# Altium project WeatherChannel.PrjPCB
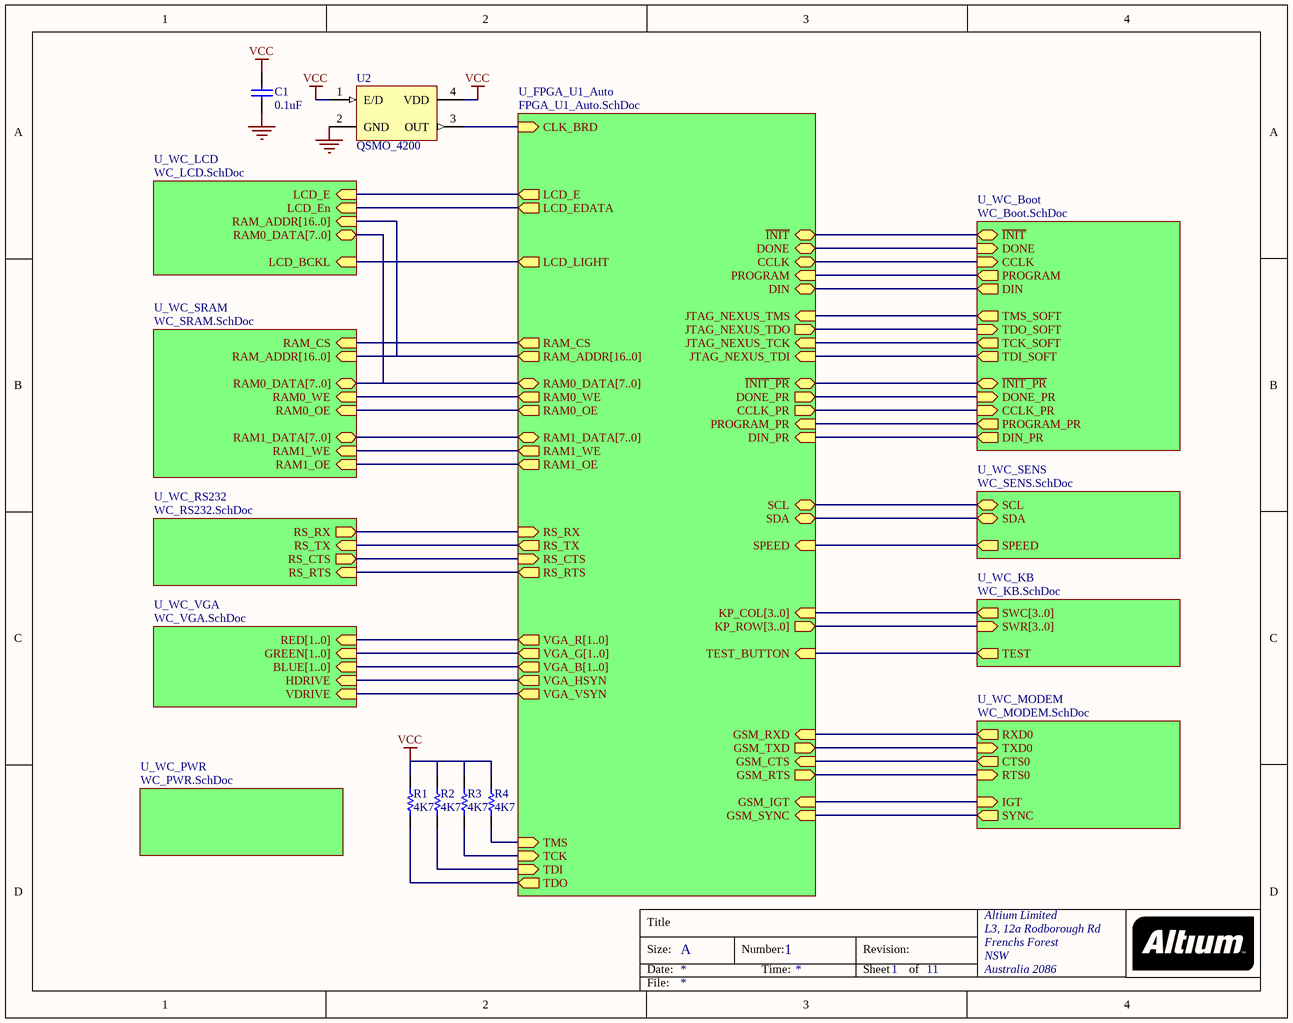
[diagram p0: FPGA_U1_Manual.SchDoc]
11 sheets, 128 parts. Net scope: hierarchical (ports join the sheet entries above them; power ports are global).
Board file: WeatherChannel.PcbDoc
Sheets:
  FPGA_U1_Manual.SchDoc
    U_FPGA_U1_Auto = FPGA_U1_Auto.SchDoc
    U_WC_SENS = WC_SENS.SchDoc
    U_WC_LCD = WC_LCD.SchDoc
    U_WC_SRAM = WC_SRAM.SchDoc
    U_WC_VGA = WC_VGA.SchDoc
    U_WC_RS232 = WC_RS232.SchDoc
    U_WC_KB = WC_KB.SchDoc
    U_WC_PWR = WC_PWR.SchDoc
    U_WC_Boot = WC_Boot.SchDoc
    U_WC_MODEM = WC_MODEM.SchDoc

## Sheet FPGA_U1_Manual.SchDoc
size A; Organization: Altium Limited; Address1: L3, 12a Rodborough Rd; Address2: Frenchs Forest; Address3: NSW; Address4: Australia 2086; DocumentNumber: 1; SheetNumber: 1; SheetTotal: 11

### Parts
C1  0.1uF  [CC2012-0805]
R1  4K7  [CC2012-0805]
R2  4K7  [CC2012-0805]
R3  4K7  [CC2012-0805]
R4  4K7  [CC2012-0805]
U2  QSMO_4200  [QSMO_4200]

### Sub-sheets
U_FPGA_U1_Auto = FPGA_U1_Auto.SchDoc: CLK_BRD (in), SPEED (in), JTAG_NEXUS_TCK (in), JTAG_NEXUS_TDI (in), JTAG_NEXUS_TDO (out), JTAG_NEXUS_TMS (in), KP_COL[3..0] (in), KP_ROW[3..0] (out), LCD_E (out), LCD_EDATA (out), LCD_LIGHT (out), RAM_ADDR[16..0] (out), RAM_CS (out), RAM0_DATA[7..0] (bidir), RAM0_OE (out), RAM0_WE (out), RAM1_DATA[7..0] (bidir), RAM1_OE (out), RAM1_WE (out), RS_CTS (in), RS_RTS (out), RS_RX (in), RS_TX (out), SCL (bidir), SDA (bidir), TEST_BUTTON (in), VGA_B[1..0] (out), VGA_G[1..0] (out), VGA_HSYN (out), VGA_R[1..0] (out), VGA_VSYN (out), CCLK (bidir), DONE (bidir), PROGRAM (in), TCK (in), TDI (in), TDO (out), TMS (in), GSM_CTS (in), GSM_IGT (in), GSM_RTS (out), GSM_RXD (in), GSM_SYNC (in), GSM_TXD (out), CCLK_PR (out), DIN_PR (in), DONE_PR (out), PROGRAM_PR (in), ~{INIT_PR} (bidir), ~{INIT} (bidir), DIN (bidir)
U_WC_Boot = WC_Boot.SchDoc: ~{INIT} (bidir), DONE (in), CCLK (in), ~{INIT_PR} (bidir), DONE_PR (in), CCLK_PR (in), DIN (out), DIN_PR (out), PROGRAM (out), PROGRAM_PR (out), TMS_SOFT (out), TDO_SOFT (in), TCK_SOFT (out), TDI_SOFT (out)
U_WC_KB = WC_KB.SchDoc: TEST (out), SWR[3..0] (in), SWC[3..0] (out)
U_WC_LCD = WC_LCD.SchDoc: LCD_E (in), LCD_BCKL (in), LCD_En (in), RAM0_DATA[7..0] (bidir), RAM_ADDR[16..0] (in)
U_WC_MODEM = WC_MODEM.SchDoc: TXD0 (in), RXD0 (out), IGT (in), RTS0 (in), CTS0 (out), SYNC (out)
U_WC_PWR = WC_PWR.SchDoc: no entries
U_WC_RS232 = WC_RS232.SchDoc: RS_RTS (in), RS_TX (in), RS_CTS (out), RS_RX (out)
U_WC_SENS = WC_SENS.SchDoc: SCL (bidir), SDA (bidir), SPEED (out)
U_WC_SRAM = WC_SRAM.SchDoc: RAM0_WE (in), RAM0_OE (in), RAM1_WE (in), RAM1_OE (in), RAM_CS (in), RAM0_DATA[7..0] (bidir), RAM1_DATA[7..0] (bidir), RAM_ADDR[16..0] (in)
U_WC_VGA = WC_VGA.SchDoc: RED[1..0] (in), GREEN[1..0] (in), BLUE[1..0] (in), HDRIVE (in), VDRIVE (in)

### Nets
GND: C1.2 U2.2(GND)
VCC: C1.1 R1.1 R2.1 R3.1 R4.1 U2.1(E/D) U2.4(VDD)
CCLK: sheet U_FPGA_U1_Auto/CCLK, sheet U_WC_Boot/CCLK
CCLK_PR: sheet U_FPGA_U1_Auto/CCLK_PR, sheet U_WC_Boot/CCLK_PR
CLK_BRD: U2.3(OUT) ; sheet U_FPGA_U1_Auto/CLK_BRD
DIN: sheet U_FPGA_U1_Auto/DIN, sheet U_WC_Boot/DIN
DIN_PR: sheet U_FPGA_U1_Auto/DIN_PR, sheet U_WC_Boot/DIN_PR
DONE: sheet U_FPGA_U1_Auto/DONE, sheet U_WC_Boot/DONE
DONE_PR: sheet U_FPGA_U1_Auto/DONE_PR, sheet U_WC_Boot/DONE_PR
GSM_CTS: sheet U_FPGA_U1_Auto/GSM_CTS, sheet U_WC_MODEM/CTS0
GSM_IGT: sheet U_FPGA_U1_Auto/GSM_IGT, sheet U_WC_MODEM/IGT
GSM_RTS: sheet U_FPGA_U1_Auto/GSM_RTS, sheet U_WC_MODEM/RTS0
GSM_RXD: sheet U_FPGA_U1_Auto/GSM_RXD, sheet U_WC_MODEM/RXD0
GSM_SYNC: sheet U_FPGA_U1_Auto/GSM_SYNC, sheet U_WC_MODEM/SYNC
GSM_TXD: sheet U_FPGA_U1_Auto/GSM_TXD, sheet U_WC_MODEM/TXD0
~{INIT}: sheet U_FPGA_U1_Auto/~{INIT}, sheet U_WC_Boot/~{INIT}
~{INIT_PR}: sheet U_FPGA_U1_Auto/~{INIT_PR}, sheet U_WC_Boot/~{INIT_PR}
JTAG_NEXUS_TCK: sheet U_FPGA_U1_Auto/JTAG_NEXUS_TCK, sheet U_WC_Boot/TCK_SOFT
JTAG_NEXUS_TDI: sheet U_FPGA_U1_Auto/JTAG_NEXUS_TDI, sheet U_WC_Boot/TDI_SOFT
JTAG_NEXUS_TDO: sheet U_FPGA_U1_Auto/JTAG_NEXUS_TDO, sheet U_WC_Boot/TDO_SOFT
JTAG_NEXUS_TMS: sheet U_FPGA_U1_Auto/JTAG_NEXUS_TMS, sheet U_WC_Boot/TMS_SOFT
LCD_BCKL: sheet U_FPGA_U1_Auto/LCD_LIGHT, sheet U_WC_LCD/LCD_BCKL
LCD_E: sheet U_FPGA_U1_Auto/LCD_E, sheet U_WC_LCD/LCD_E
LCD_EDATA: sheet U_FPGA_U1_Auto/LCD_EDATA, sheet U_WC_LCD/LCD_En
PROGRAM: sheet U_FPGA_U1_Auto/PROGRAM, sheet U_WC_Boot/PROGRAM
PROGRAM_PR: sheet U_FPGA_U1_Auto/PROGRAM_PR, sheet U_WC_Boot/PROGRAM_PR
RAM0_OE: sheet U_FPGA_U1_Auto/RAM0_OE, sheet U_WC_SRAM/RAM0_OE
RAM0_WE: sheet U_FPGA_U1_Auto/RAM0_WE, sheet U_WC_SRAM/RAM0_WE
RAM1_OE: sheet U_FPGA_U1_Auto/RAM1_OE, sheet U_WC_SRAM/RAM1_OE
RAM1_WE: sheet U_FPGA_U1_Auto/RAM1_WE, sheet U_WC_SRAM/RAM1_WE
RAM_CS: sheet U_FPGA_U1_Auto/RAM_CS, sheet U_WC_SRAM/RAM_CS
RS_CTS: sheet U_FPGA_U1_Auto/RS_CTS, sheet U_WC_RS232/RS_CTS
RS_RTS: sheet U_FPGA_U1_Auto/RS_RTS, sheet U_WC_RS232/RS_RTS
RS_RX: sheet U_FPGA_U1_Auto/RS_RX, sheet U_WC_RS232/RS_RX
RS_TX: sheet U_FPGA_U1_Auto/RS_TX, sheet U_WC_RS232/RS_TX
SCL: sheet U_FPGA_U1_Auto/SCL, sheet U_WC_SENS/SCL
SDA: sheet U_FPGA_U1_Auto/SDA, sheet U_WC_SENS/SDA
SPEED: sheet U_FPGA_U1_Auto/SPEED, sheet U_WC_SENS/SPEED
TCK: R3.2 ; sheet U_FPGA_U1_Auto/TCK
TDI: R2.2 ; sheet U_FPGA_U1_Auto/TDI
TDO: R1.2 ; sheet U_FPGA_U1_Auto/TDO
TEST: sheet U_FPGA_U1_Auto/TEST_BUTTON, sheet U_WC_KB/TEST
TMS: R4.2 ; sheet U_FPGA_U1_Auto/TMS
VGA_HSYN: sheet U_FPGA_U1_Auto/VGA_HSYN, sheet U_WC_VGA/HDRIVE
VGA_VSYN: sheet U_FPGA_U1_Auto/VGA_VSYN, sheet U_WC_VGA/VDRIVE

### Buses and harness runs
bus sheet U_FPGA_U1_Auto/KP_COL[3..0] = sheet U_WC_KB/SWC[3..0]
bus sheet U_FPGA_U1_Auto/KP_ROW[3..0] = sheet U_WC_KB/SWR[3..0]
bus sheet U_FPGA_U1_Auto/RAM0_DATA[7..0] = sheet U_WC_LCD/RAM0_DATA[7..0] = sheet U_WC_SRAM/RAM0_DATA[7..0]
bus sheet U_FPGA_U1_Auto/RAM1_DATA[7..0] = sheet U_WC_SRAM/RAM1_DATA[7..0]
bus sheet U_FPGA_U1_Auto/RAM_ADDR[16..0] = sheet U_WC_LCD/RAM_ADDR[16..0] = sheet U_WC_SRAM/RAM_ADDR[16..0]
bus sheet U_FPGA_U1_Auto/VGA_B[1..0] = sheet U_WC_VGA/BLUE[1..0]
bus sheet U_FPGA_U1_Auto/VGA_G[1..0] = sheet U_WC_VGA/GREEN[1..0]
bus sheet U_FPGA_U1_Auto/VGA_R[1..0] = sheet U_WC_VGA/RED[1..0]

### Notes on the sheet
- Title
- Size:
- Date:
- A
- Number:
- Time:
- Revision:
- Sheet
- of
- File:

### Library data of the parts
C1 = CAP: Capacitor
R1-R4 = RES: Resistor
U2 = QSMO_4200: Surface Mount Crystal Oscillator

## Sheet FPGA_U1_Auto.SchDoc
size A2; Generated From FPGA Project: WeatherChannel.PrjFpg; UNUSED_SPECIAL: RouteSeparate; UNUSED_IO: NoERC; VREF: NoERC; UNUSED_INPUT: NoERC; DocumentNumber: 11; SheetNumber: 11; SheetTotal: 11
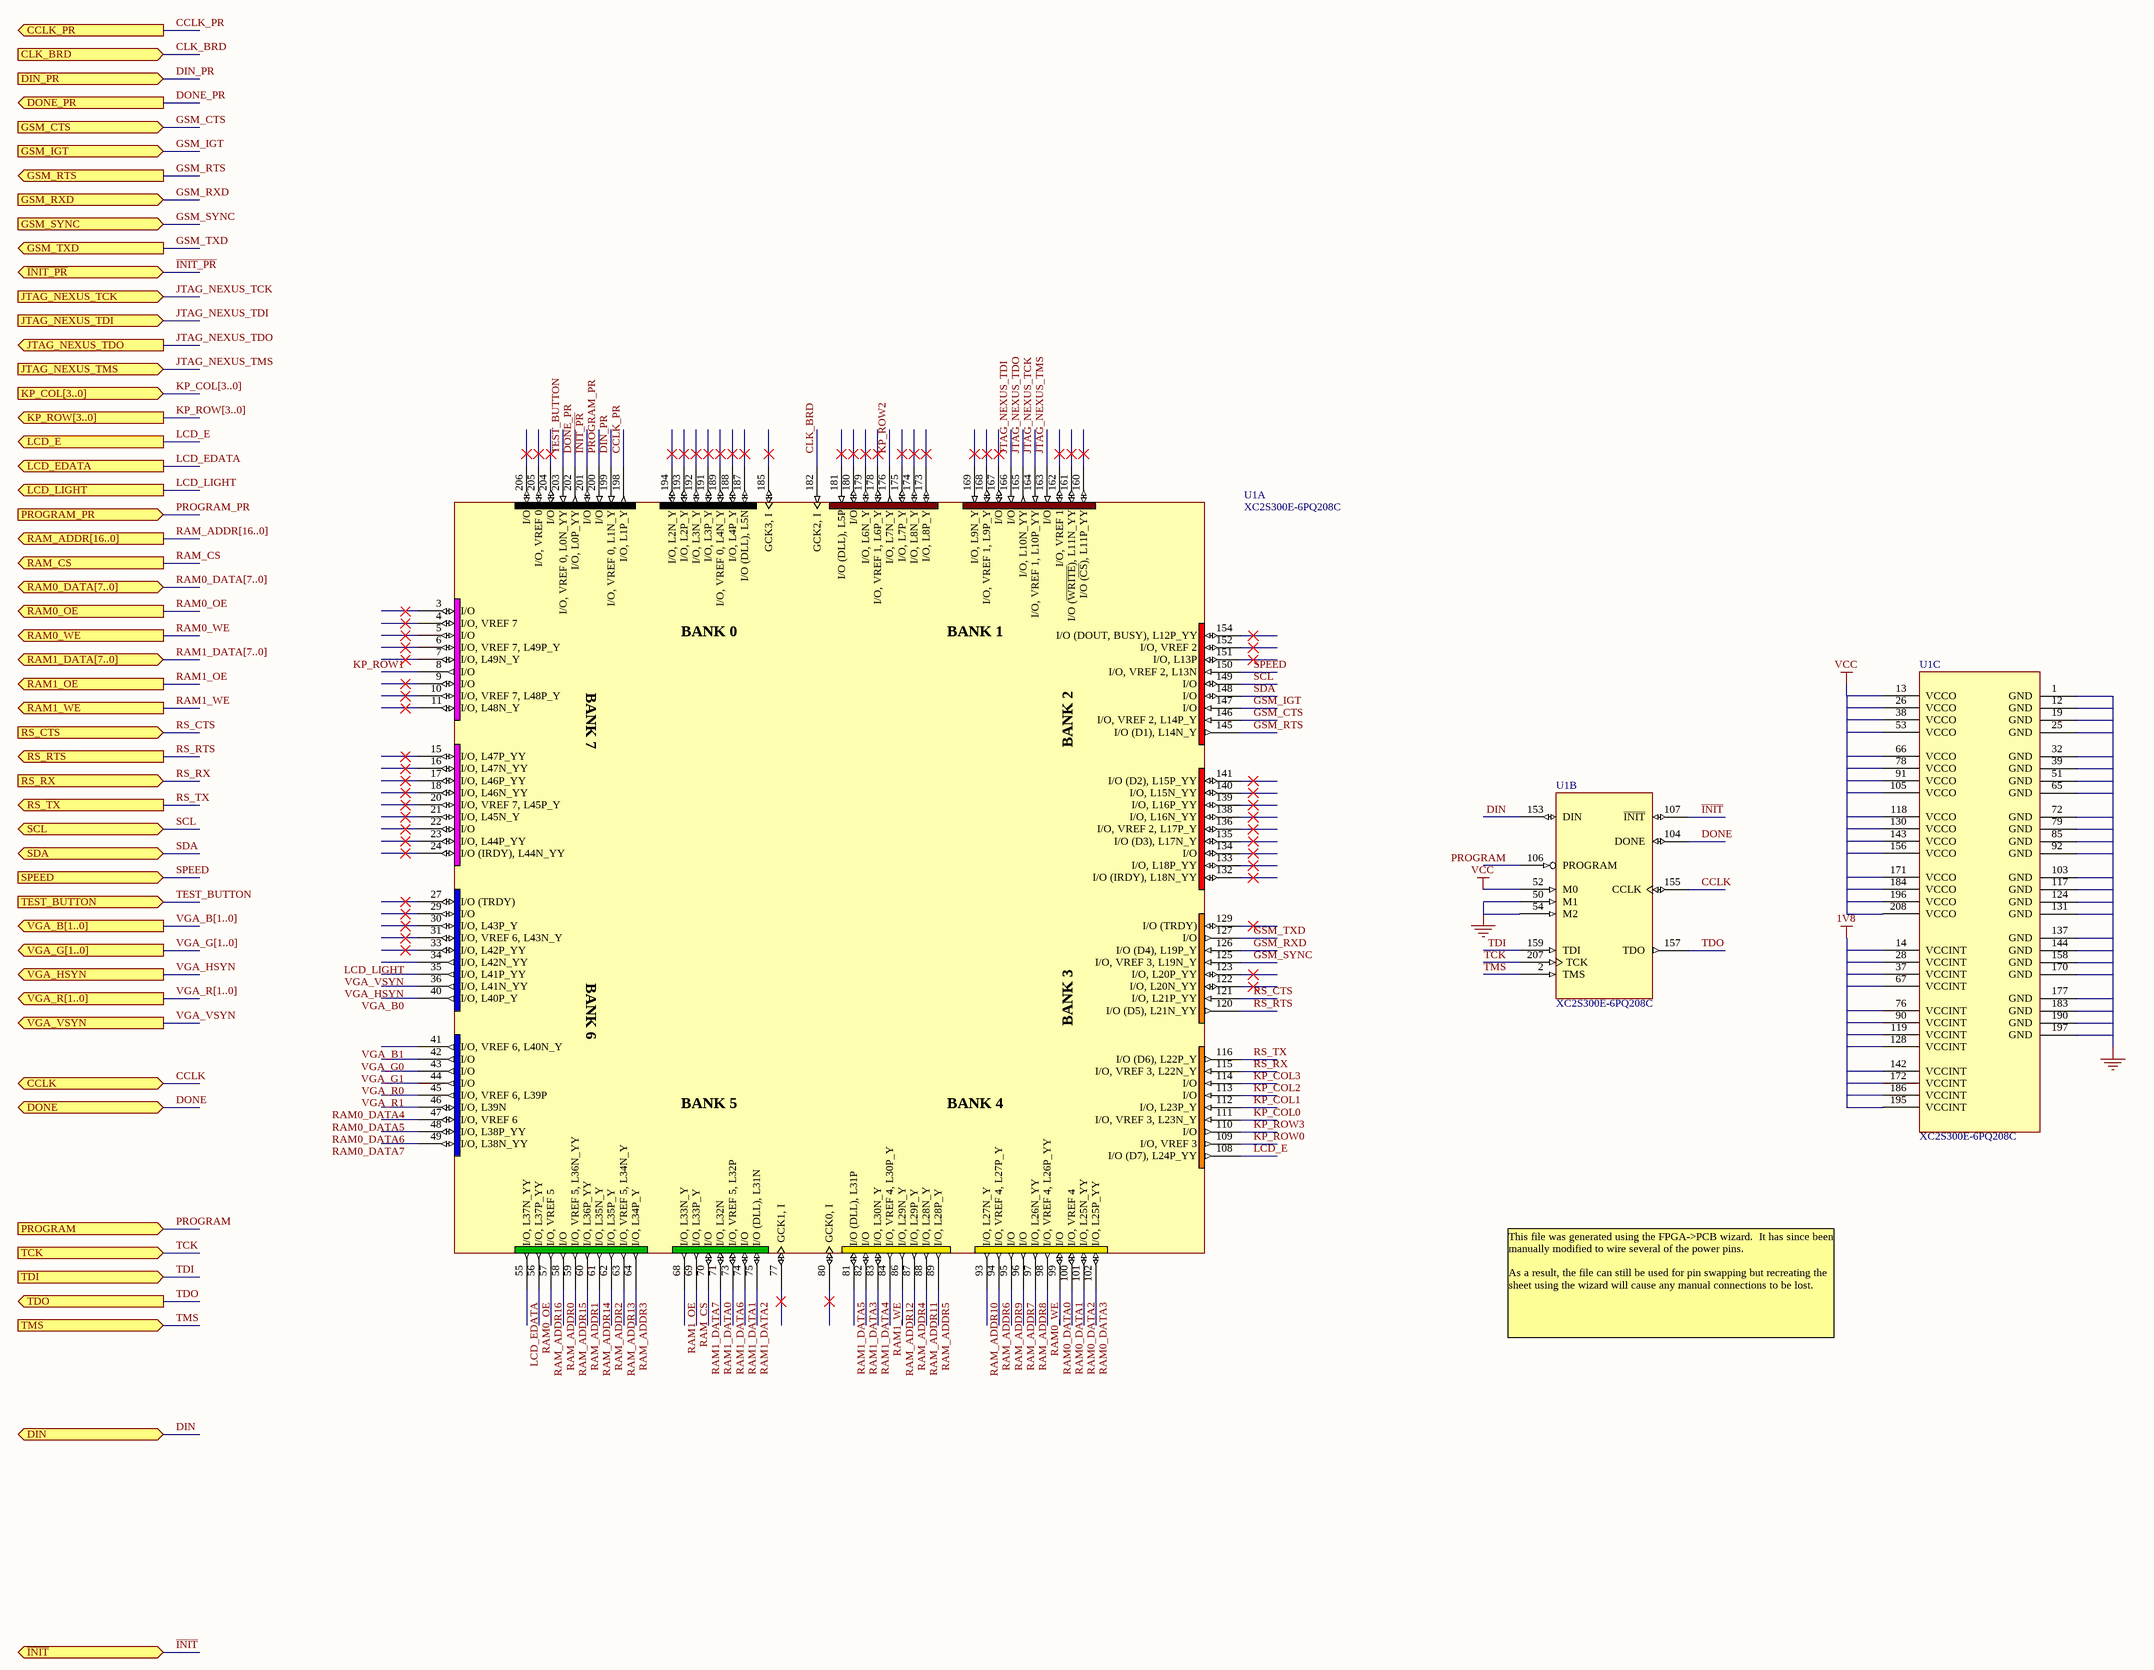
[diagram p1: FPGA_U1_Auto.SchDoc]

### Parts
U1  XC2S300E-6PQ208C  [PQ208]  (parts A,B,C of 3)

### Ports
CCLK (bidir), CCLK_PR (out), CLK_BRD (in), DIN (bidir), DIN_PR (in), DONE (bidir), DONE_PR (out), GSM_CTS (in), GSM_IGT (in), GSM_RTS (out), GSM_RXD (in), GSM_SYNC (in), GSM_TXD (out), JTAG_NEXUS_TCK (in), JTAG_NEXUS_TDI (in), JTAG_NEXUS_TDO (out), JTAG_NEXUS_TMS (in), KP_COL[3..0] (in), KP_ROW[3..0] (out), LCD_E (out), LCD_EDATA (out), LCD_LIGHT (out), PROGRAM (in), PROGRAM_PR (in), RAM0_DATA[7..0] (bidir), RAM0_OE (out), RAM0_WE (out), RAM1_DATA[7..0] (bidir), RAM1_OE (out), RAM1_WE (out), RAM_ADDR[16..0] (out), RAM_CS (out), RS_CTS (in), RS_RTS (out), RS_RX (in), RS_TX (out), SCL (bidir), SDA (bidir), SPEED (in), TCK (in), TDI (in), TDO (out), TEST_BUTTON (in), TMS (in), VGA_B[1..0] (out), VGA_G[1..0] (out), VGA_HSYN (out), VGA_R[1..0] (out), VGA_VSYN (out), ~{INIT_PR} (bidir), ~{INIT} (bidir)

### Nets
1V8: U1.14(VCCINT) U1.28(VCCINT) U1.37(VCCINT) U1.67(VCCINT) U1.76(VCCINT) U1.90(VCCINT) U1.119(VCCINT) U1.128(VCCINT) U1.142(VCCINT) U1.172(VCCINT) U1.186(VCCINT) U1.195(VCCINT)
GND: U1.1(GND) U1.12(GND) U1.19(GND) U1.25(GND) U1.32(GND) U1.39(GND) U1.50(M1) U1.51(GND) U1.54(M2) U1.65(GND) U1.72(GND) U1.79(GND) U1.85(GND) U1.92(GND) U1.103(GND) U1.117(GND) U1.124(GND) U1.131(GND) U1.137(GND) U1.144(GND) U1.158(GND) U1.170(GND) U1.177(GND) U1.183(GND) U1.190(GND) U1.197(GND)
VCC: U1.13(VCCO) U1.26(VCCO) U1.38(VCCO) U1.52(M0) U1.53(VCCO) U1.66(VCCO) U1.78(VCCO) U1.91(VCCO) U1.105(VCCO) U1.118(VCCO) U1.130(VCCO) U1.143(VCCO) U1.156(VCCO) U1.171(VCCO) U1.184(VCCO) U1.196(VCCO) U1.208(VCCO)
CCLK: U1.155(CCLK) ; port CCLK
CCLK_PR: U1.198(I/O,_L1P_Y) ; port CCLK_PR
CLK_BRD: U1.182(GCK2,_I) ; port CLK_BRD
DIN: U1.153(DIN) ; port DIN
DIN_PR: U1.199(I/O,_VREF_0,_L1N_Y) ; port DIN_PR
DONE: U1.104(DONE) ; port DONE
DONE_PR: U1.202(I/O,_L0P_YY) ; port DONE_PR
GSM_CTS: U1.146(I/O,_VREF_2,_L14P_Y) ; port GSM_CTS
GSM_IGT: U1.147(I/O) ; port GSM_IGT
GSM_RTS: U1.145(I/O_(D1),_L14N_Y) ; port GSM_RTS
GSM_RXD: U1.126(I/O_(D4),_L19P_Y) ; port GSM_RXD
GSM_SYNC: U1.125(I/O,_VREF_3,_L19N_Y) ; port GSM_SYNC
GSM_TXD: U1.127(I/O) ; port GSM_TXD
~{INIT}: U1.107(~{INIT}) ; port ~{INIT}
~{INIT_PR}: U1.201(I/O) ; port ~{INIT_PR}
JTAG_NEXUS_TCK: U1.164(I/O,_VREF_1,_L10P_YY) ; port JTAG_NEXUS_TCK
JTAG_NEXUS_TDI: U1.166(I/O) ; port JTAG_NEXUS_TDI
JTAG_NEXUS_TDO: U1.165(I/O,_L10N_YY) ; port JTAG_NEXUS_TDO
JTAG_NEXUS_TMS: U1.163(I/O) ; port JTAG_NEXUS_TMS
KP_COL0: U1.111(I/O,_VREF_3,_L23N_Y)
KP_COL1: U1.112(I/O,_L23P_Y)
KP_COL2: U1.113(I/O)
KP_COL3: U1.114(I/O)
KP_ROW0: U1.109(I/O,_VREF_3)
KP_ROW1: U1.8(I/O)
KP_ROW2: U1.176(I/O,_L7N_Y)
KP_ROW3: U1.110(I/O)
LCD_E: U1.108(I/O_(D7),_L24P_YY) ; port LCD_E
LCD_EDATA: U1.55(I/O,_L37N_YY) ; port LCD_EDATA
LCD_LIGHT: U1.34(I/O,_L42N_YY) ; port LCD_LIGHT  [project net LCD_BCKL]
PROGRAM: U1.106(PROGRAM) ; port PROGRAM
PROGRAM_PR: U1.200(I/O) ; port PROGRAM_PR
RAM0_DATA0: U1.99(I/O)
RAM0_DATA1: U1.100(I/O,_VREF_4)
RAM0_DATA2: U1.101(I/O,_L25N_YY)
RAM0_DATA3: U1.102(I/O,_L25P_YY)
RAM0_DATA4: U1.46(I/O,_L39N)
RAM0_DATA5: U1.47(I/O,_VREF_6)
RAM0_DATA6: U1.48(I/O,_L38P_YY)
RAM0_DATA7: U1.49(I/O,_L38N_YY)
RAM0_OE: U1.56(I/O,_L37P_YY) ; port RAM0_OE
RAM0_WE: U1.98(I/O,_VREF_4,_L26P_YY) ; port RAM0_WE
RAM1_DATA0: U1.71(I/O,_L32N)
RAM1_DATA1: U1.74(I/O)
RAM1_DATA2: U1.75(I/O_(DLL),_L31N)
RAM1_DATA3: U1.82(I/O)
RAM1_DATA4: U1.83(I/O,_L30N_Y)
RAM1_DATA5: U1.81(I/O_(DLL),_L31P)
RAM1_DATA6: U1.73(I/O,_VREF_5,_L32P)
RAM1_DATA7: U1.70(I/O)
RAM1_OE: U1.68(I/O,_L33N_Y) ; port RAM1_OE
RAM1_WE: U1.84(I/O,_VREF_4,_L30P_Y) ; port RAM1_WE
RAM_ADDR0: U1.58(I/O)
RAM_ADDR1: U1.60(I/O,_L36P_YY)
RAM_ADDR2: U1.62(I/O,_L35P_Y)
RAM_ADDR3: U1.64(I/O,_L34P_Y)
RAM_ADDR4: U1.87(I/O,_L29P_Y)
RAM_ADDR5: U1.89(I/O,_L28P_Y)
RAM_ADDR6: U1.94(I/O,_VREF_4,_L27P_Y)
RAM_ADDR7: U1.96(I/O)
RAM_ADDR8: U1.97(I/O,_L26N_YY)
RAM_ADDR9: U1.95(I/O)
RAM_ADDR10: U1.93(I/O,_L27N_Y)
RAM_ADDR11: U1.88(I/O,_L28N_Y)
RAM_ADDR12: U1.86(I/O,_L29N_Y)
RAM_ADDR13: U1.63(I/O,_VREF_5,_L34N_Y)
RAM_ADDR14: U1.61(I/O,_L35N_Y)
RAM_ADDR15: U1.59(I/O,_VREF_5,_L36N_YY)
RAM_ADDR16: U1.57(I/O,_VREF_5)
RAM_CS: U1.69(I/O,_L33P_Y) ; port RAM_CS
RS_CTS: U1.121(I/O,_L21P_YY) ; port RS_CTS
RS_RTS: U1.120(I/O_(D5),_L21N_YY) ; port RS_RTS
RS_RX: U1.115(I/O,_VREF_3,_L22N_Y) ; port RS_RX
RS_TX: U1.116(I/O_(D6),_L22P_Y) ; port RS_TX
SCL: U1.149(I/O) ; port SCL
SDA: U1.148(I/O) ; port SDA
SPEED: U1.150(I/O,_VREF_2,_L13N) ; port SPEED
TCK: U1.207(TCK) ; port TCK
TDI: U1.159(TDI) ; port TDI
TDO: U1.157(TDO) ; port TDO
TEST_BUTTON: U1.203(I/O,_VREF_0,_L0N_YY) ; port TEST_BUTTON  [project net TEST]
TMS: U1.2(TMS) ; port TMS
VGA_B0: U1.40(I/O,_L40P_Y)  [project net BLUE0]
VGA_B1: U1.41(I/O,_VREF_6,_L40N_Y)  [project net BLUE1]
VGA_G0: U1.42(I/O)  [project net GREEN0]
VGA_G1: U1.43(I/O)  [project net GREEN1]
VGA_HSYN: U1.36(I/O,_L41N_YY) ; port VGA_HSYN
VGA_R0: U1.44(I/O)  [project net RED0]
VGA_R1: U1.45(I/O,_VREF_6,_L39P)  [project net RED1]
VGA_VSYN: U1.35(I/O,_L41P_YY) ; port VGA_VSYN

Not connected (* = marked no-connect by the designer): U1 3(I/O)* 4(I/O,_VREF_7)* 5(I/O)* 6(I/O,_VREF_7,_L49P_Y)* 7(I/O,_L49N_Y)* 9(I/O)* 10(I/O,_VREF_7,_L48P_Y)* 11(I/O,_L48N_Y)* 15(I/O,_L47P_YY)* 16(I/O,_L47N_YY)* 17(I/O,_L46P_YY)* 18(I/O,_L46N_YY)* 20(I/O,_VREF_7,_L45P_Y)* 21(I/O,_L45N_Y)* 22(I/O)* 23(I/O,_L44P_YY)* 24(I/O_(IRDY),_L44N_YY)* 27(I/O_(TRDY))* 29(I/O)* 30(I/O,_L43P_Y)* 31(I/O,_VREF_6,_L43N_Y)* 33(I/O,_L42P_YY)* 77(GCK1,_I)* 80(GCK0,_I)* 122(I/O,_L20N_YY)* 123(I/O,_L20P_YY)* 129(I/O_(TRDY))* 132(I/O_(IRDY),_L18N_YY)* 133(I/O,_L18P_YY)* 134(I/O)* 135(I/O_(D3),_L17N_Y)* 136(I/O,_VREF_2,_L17P_Y)* 138(I/O,_L16N_YY)* 139(I/O,_L16P_YY)* 140(I/O,_L15N_YY)* 141(I/O_(D2),_L15P_YY)* 151(I/O,_L13P)* 152(I/O,_VREF_2)* 154(I/O_(DOUT,_BUSY),_L12P_YY)* 160(I/O_(~{CS}),_L11P_YY)* 161(I/O_(~{WRITE}),_L11N_YY)* 162(I/O,_VREF_1)* 167(I/O)* 168(I/O,_VREF_1,_L9P_Y)* 169(I/O,_L9N_Y)* 173(I/O,_L8P_Y)* 174(I/O,_L8N_Y)* 175(I/O,_L7P_Y)* 178(I/O,_VREF_1,_L6P_Y)* 179(I/O,_L6N_Y)* 180(I/O)* 181(I/O_(DLL),_L5P)* 185(GCK3,_I)* 187(I/O_(DLL),_L5N)* 188(I/O,_L4P_Y)* 189(I/O,_VREF_0,_L4N_Y)* 191(I/O,_L3P_Y)* 192(I/O,_L3N_Y)* 193(I/O,_L2P_Y)* 194(I/O,_L2N_Y)* 204(I/O)* 205(I/O,_VREF_0)* 206(I/O)*

### Buses and harness runs
bus KP_COL[3..0] = port KP_COL[3..0]
bus KP_ROW[3..0] = port KP_ROW[3..0]
bus RAM0_DATA[7..0] = port RAM0_DATA[7..0]
bus RAM1_DATA[7..0] = port RAM1_DATA[7..0]
bus RAM_ADDR[16..0] = port RAM_ADDR[16..0]
bus VGA_B[1..0] = port VGA_B[1..0]
bus VGA_G[1..0] = port VGA_G[1..0]
bus VGA_R[1..0] = port VGA_R[1..0]

### Notes on the sheet
- This file was generated using the FPGA->PCB wizard.  It has since been manually modified to wire several of the power pins.
  As a result, the file can still be used for pin swapping but recreating the sheet using the wizard will cause any manual connections to be lost.
- (in symbol XC2S300E-6PQ208C, part A) BANK 0; BANK 1; BANK 7; BANK 2; BANK 6; BANK 3; BANK 5; BANK 4

### Library data of the parts
U1 = XC2S300E-6PQ208C: Spartan-IIE 1.8V FPGA, 208-Pin PQFP, Standard Performance, Commercial Grade; Package Information: Latest Revision: ver1.1, Oct-2002; Code - JEDEC: MS-029-FA-1; Published: 19-Jul-2002; Revision: 17-Sep-2003: Pin names updated to match datasheet, ver2.1.; Datasheet: Latest Revision: 09-Jul-2003; Package Reference: PQ208; Publisher: Altium Limited

## Sheet WC_SENS.SchDoc
size A; Organization: Altium Limited; Address1: L3, 12a Rodborough Rd; Address2: Frenchs Forest; Address3: NSW; Address4: Australia 2086; DocumentNumber: 10; SheetNumber: 10; SheetTotal: 11
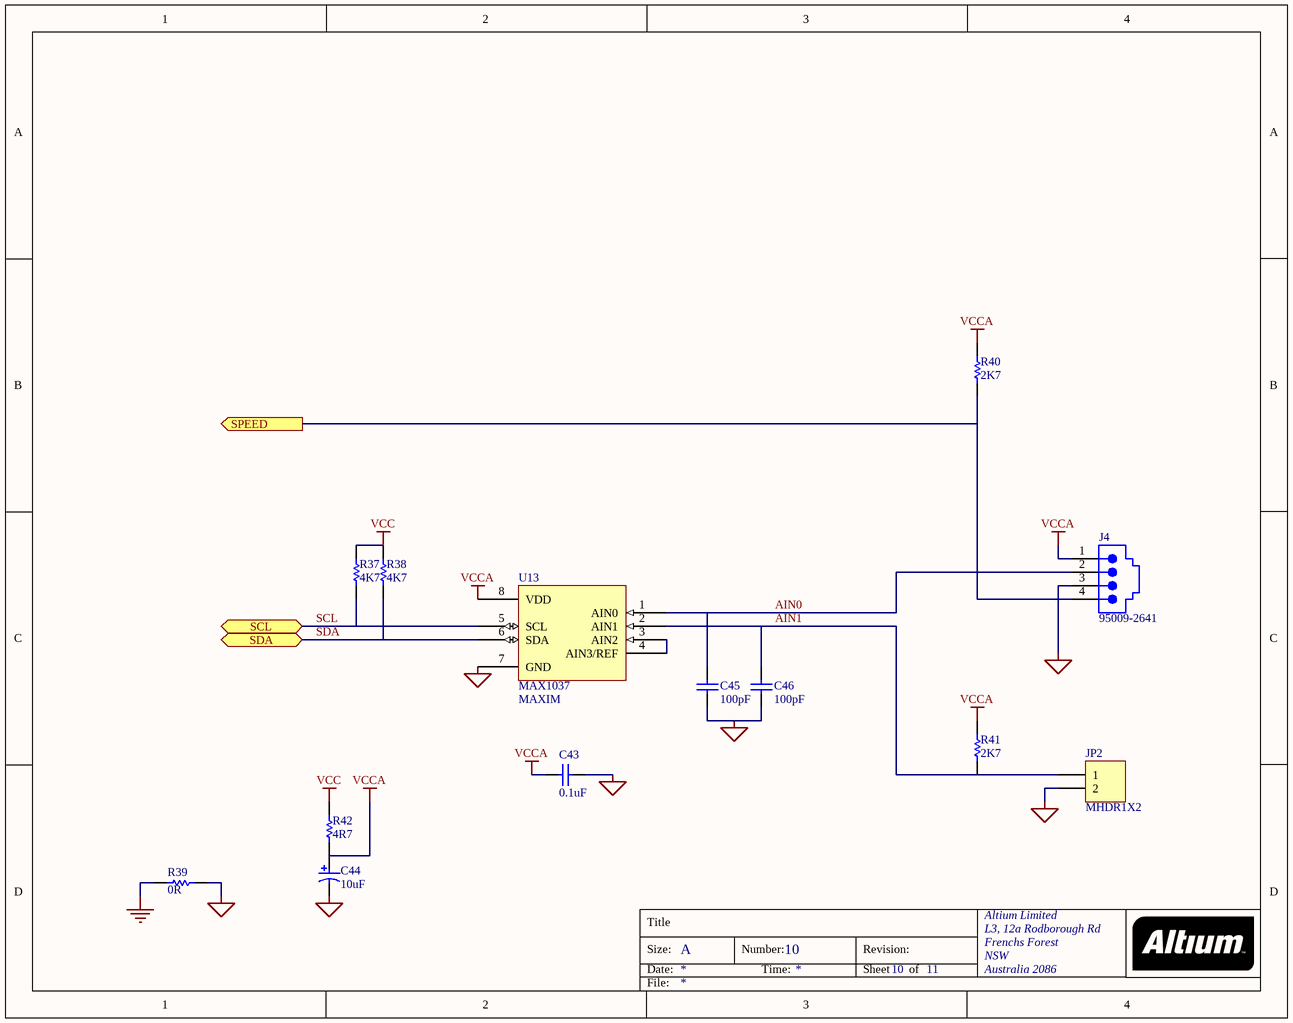
[diagram p2: WC_SENS.SchDoc]

### Parts
C43  0.1uF  [CC2012-0805]
C44  10uF  [MCCT-B]
C45  100pF  [CC2012-0805]
C46  100pF  [CC2012-0805]
J4  95009-2641  [JACK1.27-2H4D]
JP2  MHDR1X2  [TS2.54x2]
R37  4K7  [CC2012-0805]
R38  4K7  [CC2012-0805]
R39  0R  [CC2012-0805]
R40  2K7  [CC2012-0805]
R41  2K7  [CC2012-0805]
R42  4R7  [CC2012-0805]
U13  MAX1037  Supplier: MAXIM  [SOT23_8]

### Ports
SCL (bidir), SDA (bidir), SPEED (out)

### Nets
AGND: C43.2 C44.2 C45.2 C46.2 J4.3 JP2.2 R39.2 U13.7(GND)
GND: R39.1
VCC: R37.1 R38.1 R42.1
VCCA: C43.1 C44.1 J4.1 R40.1 R41.1 R42.2 U13.8(VDD)
AIN0: C45.1 J4.2 U13.1(AIN0)
AIN1: C46.1 JP2.1 R41.2 U13.2(AIN1)
SCL: R37.2 U13.5(SCL) ; port SCL
SDA: R38.2 U13.6(SDA) ; port SDA
SPEED: J4.4 R40.2 ; port SPEED
NetU13_3: U13.3(AIN2) U13.4(AIN3/REF)

### Notes on the sheet
- Title
- Size:
- Date:
- A
- Number:
- Time:
- Revision:
- Sheet
- of
- File:

### Library data of the parts
C43 C45 C46 = CAP: Capacitor
C44 = CAP_POLAR: Polar Capacitor
J4 = 95009-2641: Right Angle, Standard Profile, with Mounting Rib, Flush Mount PCB Jack; Manufacturer: Molex; Package Information: Latest Revision: Dec-2001; Ports: 1; Positions/Loaded: Port1; PCB Mounting: Thru-Hole; Drill Diameter: Nominal, Rounded to nearest 0.05mm; PCB Layout: Complies with Manufacturer's Recommendation.; Published: 25-Jun-2002; Datasheet: Latest Revision: 18-Dec-2001; Package Reference: JACK1.27-2H4D; Publisher: Altium Limited; Category: 3
JP2 = MHDR1X2: Header, 2-Pin; Manufacturer: Generic Components; Class I: Connector; Revision: July-2002: Re-released for DXP Platform.; Publisher: Altium Limited
R37-R42 = RES: Resistor
U13 = MAX1037: 4 Channel 8 Bit ADC, I2C interface, 2.7V to 3.6V Supply

## Sheet WC_LCD.SchDoc
size A; Organization: Altium Limited; Address1: L3, 12a Rodborough Rd; Address2: Frenchs Forest; Address3: NSW; Address4: Australia 2086; DocumentNumber: 2; SheetNumber: 2; SheetTotal: 11
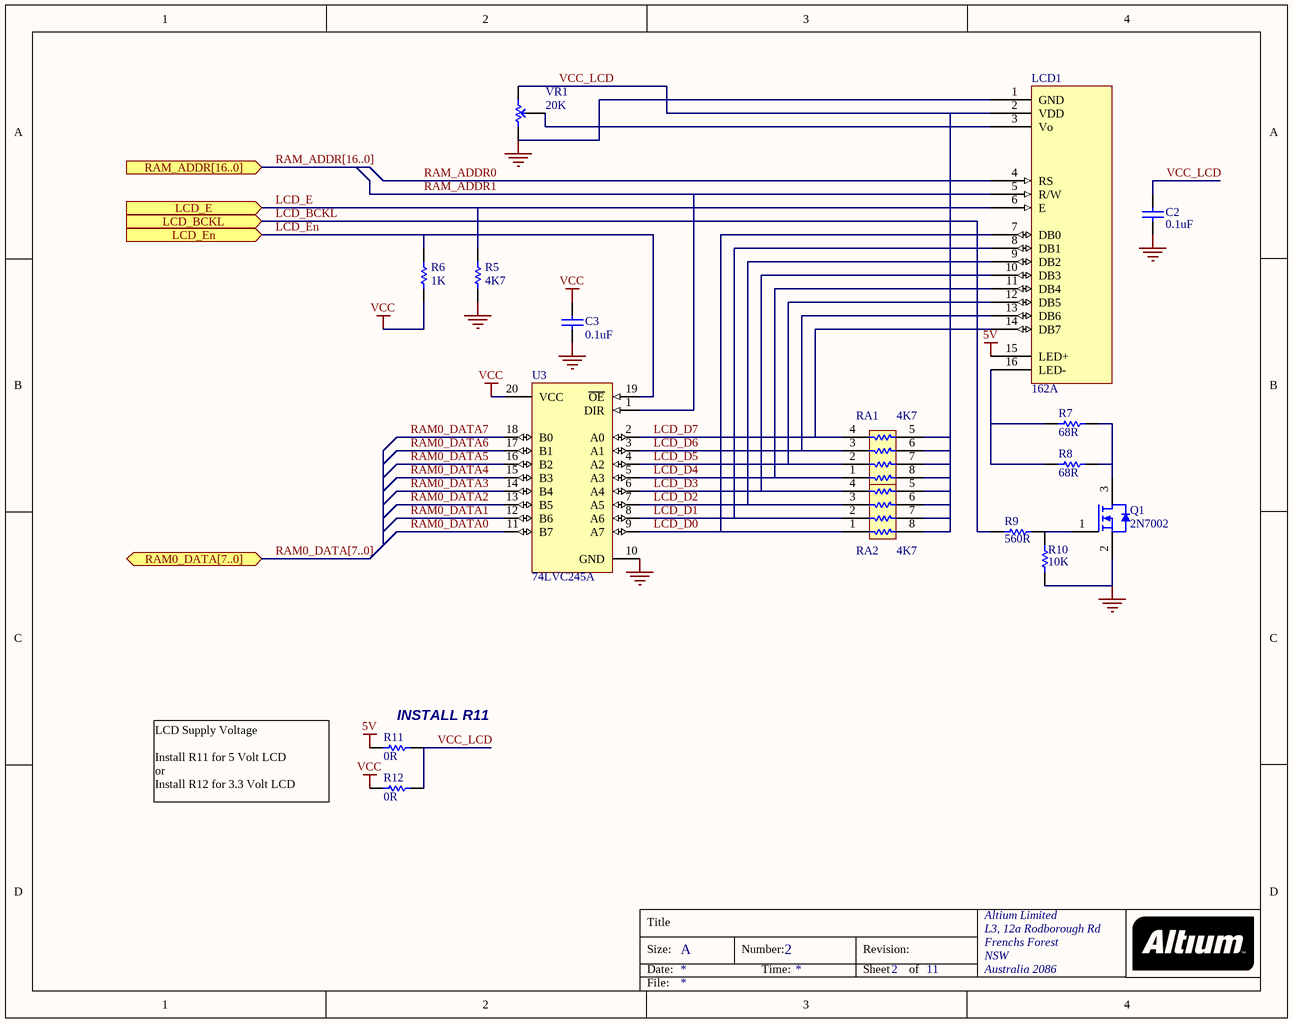
[diagram p3: WC_LCD.SchDoc]

### Parts
C2  0.1uF  [CC2012-0805]
C3  0.1uF  [CC2012-0805]
LCD1  162A  [162A]
Q1  2N7002  [SO-G3]
R5  4K7  [CC2012-0805]
R6  1K  [CC2012-0805]
R7  68R  [CC2012-0805]
R8  68R  [CC2012-0805]
R9  560R  [CC2012-0805]
R10  10K  [CC2012-0805]
R11  0R  [CC2012-0805]
R12  0R  [CC2012-0805]
RA1  4K7  [MNR34]
RA2  4K7  [MNR34]
U3  74LVC245A  [SSO-G20/P.65]
VR1  20K  [POT4MM-2]

### Ports
LCD_BCKL (in), LCD_E (in), LCD_En (in), RAM0_DATA[7..0] (bidir), RAM_ADDR[16..0] (in)

### Nets
5V: LCD1.15(LED+) R11.1
GND: C2.2 C3.2 LCD1.1(GND) Q1.2 R5.2 R10.1 U3.10(GND) VR1.CCW(-)
VCC: C3.1 R6.2 R12.1 U3.20(VCC)
LCD_BCKL: R9.1 ; port LCD_BCKL
LCD_D0: LCD1.7(DB0) RA2.1 U3.9(A7)
LCD_D1: LCD1.8(DB1) RA2.2 U3.8(A6)
LCD_D2: LCD1.9(DB2) RA2.3 U3.7(A5)
LCD_D3: LCD1.10(DB3) RA2.4 U3.6(A4)
LCD_D4: LCD1.11(DB4) RA1.1 U3.5(A3)
LCD_D5: LCD1.12(DB5) RA1.2 U3.4(A2)
LCD_D6: LCD1.13(DB6) RA1.3 U3.3(A1)
LCD_D7: LCD1.14(DB7) RA1.4 U3.2(A0)
LCD_E: LCD1.6(E) R5.1 ; port LCD_E
LCD_En: R6.1 U3.19(~{OE}) ; port LCD_En  [project net LCD_EDATA]
RAM0_DATA0: U3.11(B7)
RAM0_DATA1: U3.12(B6)
RAM0_DATA2: U3.13(B5)
RAM0_DATA3: U3.14(B4)
RAM0_DATA4: U3.15(B3)
RAM0_DATA5: U3.16(B2)
RAM0_DATA6: U3.17(B1)
RAM0_DATA7: U3.18(B0)
RAM_ADDR0: LCD1.4(RS)
RAM_ADDR1: LCD1.5(R/W) U3.1(DIR)
VCC_LCD: C2.1 LCD1.2(VDD) R11.2 R12.2 RA1.5 RA1.6 RA1.7 RA1.8 RA2.5 RA2.6 RA2.7 RA2.8 VR1.CW(+)
NetLCD1_3: LCD1.3(Vo) VR1.W
NetLCD1_16: LCD1.16(LED-) R7.1 R8.1
NetQ1_1: Q1.1 R9.2 R10.2
NetQ1_3: Q1.3 R7.2 R8.2

### Buses and harness runs
bus RAM0_DATA[7..0] = port RAM0_DATA[7..0]
bus RAM_ADDR[16..0] = port RAM_ADDR[16..0]

### Notes on the sheet
- (near R11) INSTALL R11
- LCD Supply Voltage
  Install R11 for 5 Volt LCD
  or
  Install R12 for 3.3 Volt LCD
- Title
- Size:
- Date:
- A
- Number:
- Time:
- Revision:
- Sheet
- of
- File:

### Library data of the parts
C2 C3 = CAP: Capacitor
LCD1 = 162A: 16 char * 2 line LCD character display with b/light
Q1 = 2N7002: N Channel Mosfet
R5-R12 = RES: Resistor
RA1 RA2 = MNR34: 3216x4 Resistor Array
U3 = 74LVC245A: Octal Bus Transceiver with 3-State Outputs; Manufacturer: Texas Instruments; Revision 1: 12-July-2000: SIM Model Added.; Revision 2: July-2002: Re-released for DXP Platform.; Class I: Interface; Class II: Line Transceiver; Published: 8-Jun-2000; Datasheet: Latest Revision: Oct-1993; Package Reference: J020; Publisher: Altium Limited
VR1 = POT_M: Potentiometer

## Sheet WC_SRAM.SchDoc
size A; Organization: Altium Limited; Address1: L3, 12a Rodborough Rd; Address2: Frenchs Forest; Address3: NSW; Address4: Australia 2086; DocumentNumber: 5; SheetNumber: 5; SheetTotal: 11
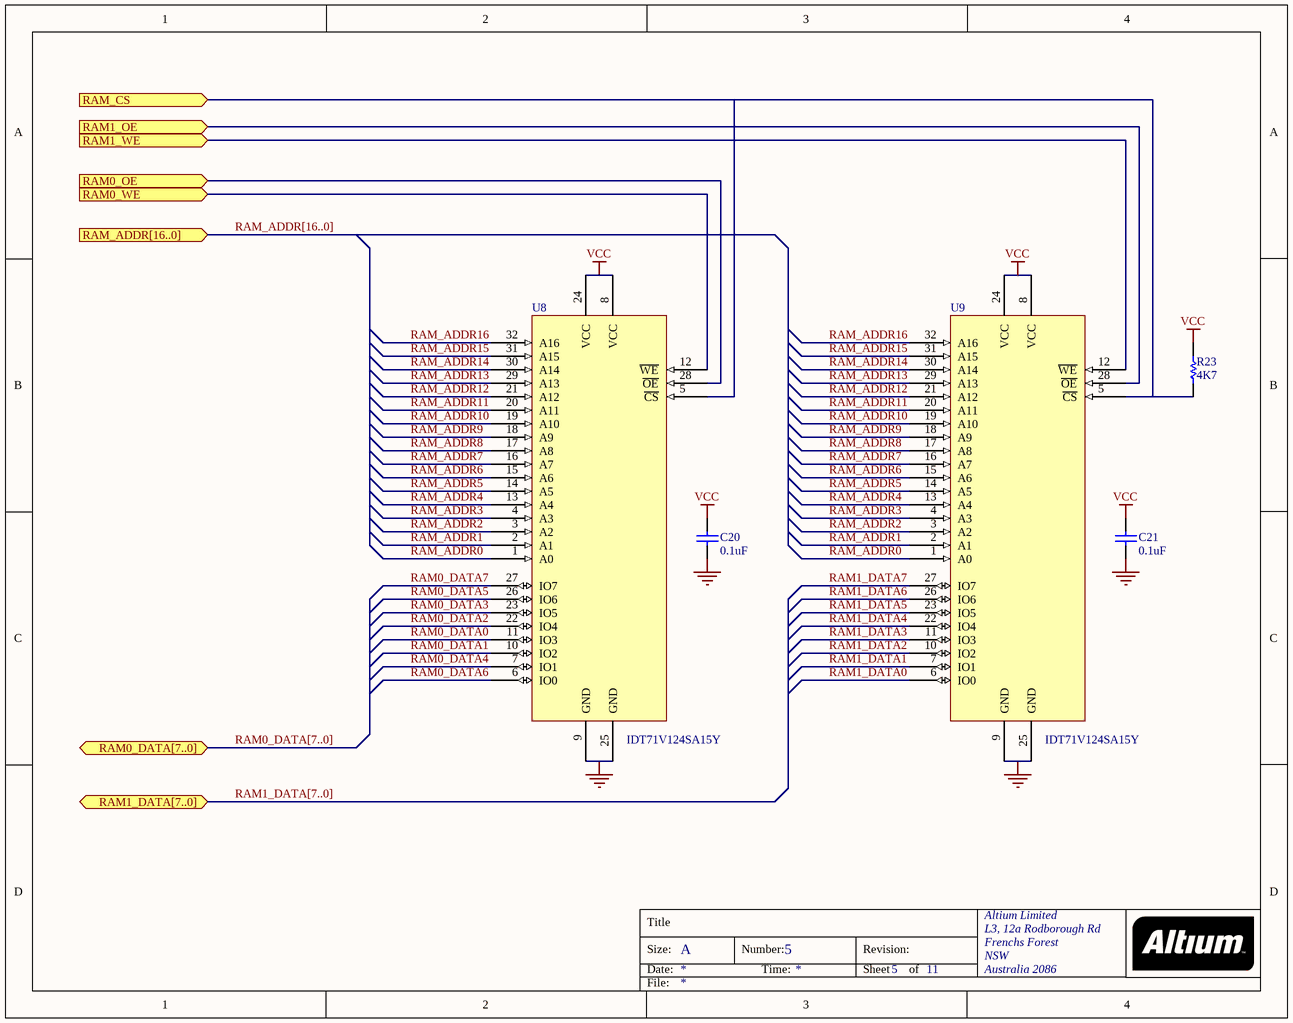
[diagram p4: WC_SRAM.SchDoc]

### Parts
C20  0.1uF  [CC2012-0805]
C21  0.1uF  [CC2012-0805]
R23  4K7  [CC2012-0805]
U8  IDT71V124SA15Y  [SO-J32]
U9  IDT71V124SA15Y  [SO-J32]

### Ports
RAM0_DATA[7..0] (bidir), RAM0_OE (in), RAM0_WE (in), RAM1_DATA[7..0] (bidir), RAM1_OE (in), RAM1_WE (in), RAM_ADDR[16..0] (in), RAM_CS (in)

### Nets
GND: C20.2 C21.2 U8.9(GND) U8.25(GND) U9.9(GND) U9.25(GND)
VCC: C20.1 C21.1 R23.1 U8.8(VCC) U8.24(VCC) U9.8(VCC) U9.24(VCC)
RAM0_DATA0: U8.11(IO3)
RAM0_DATA1: U8.10(IO2)
RAM0_DATA2: U8.22(IO4)
RAM0_DATA3: U8.23(IO5)
RAM0_DATA4: U8.7(IO1)
RAM0_DATA5: U8.26(IO6)
RAM0_DATA6: U8.6(IO0)
RAM0_DATA7: U8.27(IO7)
RAM0_OE: U8.28(~{OE}) ; port RAM0_OE
RAM0_WE: U8.12(~{WE}) ; port RAM0_WE
RAM1_DATA0: U9.6(IO0)
RAM1_DATA1: U9.7(IO1)
RAM1_DATA2: U9.10(IO2)
RAM1_DATA3: U9.11(IO3)
RAM1_DATA4: U9.22(IO4)
RAM1_DATA5: U9.23(IO5)
RAM1_DATA6: U9.26(IO6)
RAM1_DATA7: U9.27(IO7)
RAM1_OE: U9.28(~{OE}) ; port RAM1_OE
RAM1_WE: U9.12(~{WE}) ; port RAM1_WE
RAM_ADDR0: U8.1(A0) U9.1(A0)
RAM_ADDR1: U8.2(A1) U9.2(A1)
RAM_ADDR2: U8.3(A2) U9.3(A2)
RAM_ADDR3: U8.4(A3) U9.4(A3)
RAM_ADDR4: U8.13(A4) U9.13(A4)
RAM_ADDR5: U8.14(A5) U9.14(A5)
RAM_ADDR6: U8.15(A6) U9.15(A6)
RAM_ADDR7: U8.16(A7) U9.16(A7)
RAM_ADDR8: U8.17(A8) U9.17(A8)
RAM_ADDR9: U8.18(A9) U9.18(A9)
RAM_ADDR10: U8.19(A10) U9.19(A10)
RAM_ADDR11: U8.20(A11) U9.20(A11)
RAM_ADDR12: U8.21(A12) U9.21(A12)
RAM_ADDR13: U8.29(A13) U9.29(A13)
RAM_ADDR14: U8.30(A14) U9.30(A14)
RAM_ADDR15: U8.31(A15) U9.31(A15)
RAM_ADDR16: U8.32(A16) U9.32(A16)
RAM_CS: R23.2 U8.5(~{CS}) U9.5(~{CS}) ; port RAM_CS

### Buses and harness runs
bus RAM0_DATA[7..0] = port RAM0_DATA[7..0]
bus RAM1_DATA[7..0] = port RAM1_DATA[7..0]
bus RAM_ADDR[16..0] = port RAM_ADDR[16..0]

### Notes on the sheet
- Title
- Size:
- Date:
- A
- Number:
- Time:
- Revision:
- Sheet
- of
- File:

### Library data of the parts
C20 C21 = CAP: Capacitor; Supplier: FARNELL; Supplier Code: 317-287
R23 = RES: Resistor
U8 U9 = IDT71V124SA15Y: 128K x 8 bit Fast Static RAM; Supplier: IDT

## Sheet WC_VGA.SchDoc
size A; Organization: Altium Limited; Address1: L3, 12a Rodborough Rd; Address2: Frenchs Forest; Address3: NSW; Address4: Australia 2086; DocumentNumber: 6; SheetNumber: 6; SheetTotal: 11
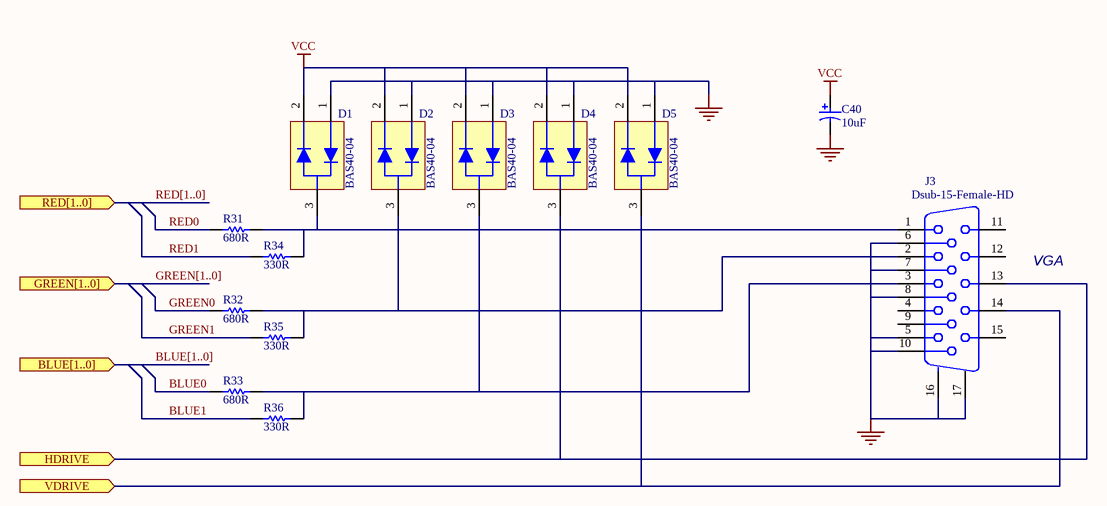
[diagram p5: WC_VGA.SchDoc]

### Parts
C40  10uF  [MCCT-B]
D1  BAS40-04  [SO-G3]
D2  BAS40-04  [SO-G3]
D3  BAS40-04  [SO-G3]
D4  BAS40-04  [SO-G3]
D5  BAS40-04  [SO-G3]
J3  Dsub-15-Female-HD  [DB15-VGA-Female]
R31  680R  [CC2012-0805]
R32  680R  [CC2012-0805]
R33  680R  [CC2012-0805]
R34  330R  [CC2012-0805]
R35  330R  [CC2012-0805]
R36  330R  [CC2012-0805]

### Ports
BLUE[1..0] (in), GREEN[1..0] (in), HDRIVE (in), RED[1..0] (in), VDRIVE (in)

### Nets
GND: C40.2 D1.1 D2.1 D3.1 D4.1 D5.1 J3.5 J3.6 J3.7 J3.8 J3.10 J3.16(MH1) J3.17(MH2)
VCC: C40.1 D1.2 D2.2 D3.2 D4.2 D5.2
BLUE0: R33.1
BLUE1: R36.1
GREEN0: R32.1
GREEN1: R35.1
RED0: R31.1
RED1: R34.1
VGA_HSYN: D4.3 J3.13 ; port HDRIVE
VGA_VSYN: D5.3 J3.14 ; port VDRIVE
NetD1_3: D1.3 J3.1 R31.2 R34.2
NetD2_3: D2.3 J3.2 R32.2 R35.2
NetD3_3: D3.3 J3.3 R33.2 R36.2

Not connected (* = marked no-connect by the designer): J3 4 9 11 12 15

### Buses and harness runs
bus BLUE[1..0] = port BLUE[1..0]
bus GREEN[1..0] = port GREEN[1..0]
bus RED[1..0] = port RED[1..0]

### Notes on the sheet
- VGA
- Title
- Size:
- Date:
- A
- Number:
- Time:
- Revision:
- Sheet
- of
- File:

### Library data of the parts
C40 = CAP_POLAR: Polar Capacitor; Supplier: FARNELL; Supplier Code: 967-117
D1-D5 = BAS40-04: Shottky Diode Pair
J3 = Dsub-15-Female-HD: Dsub-15 High density VGA Female connetor; Manufacturer: Generic Components; Package Information: Latest Revision: E; Class I: Connector; Positions: 30; Gender: Receptacle Header; Published: 15-Jun-2001; Revision: July-2002: Re-released for DXP Platform.; Datasheet: (31-Oct-1991); Package Reference: 174213; Publisher: Altium Limited; Orientation: Right Angle
R31-R36 = RES: Resistor

## Sheet WC_RS232.SchDoc
size A; Organization: Altium Limited; Address1: L3, 12a Rodborough Rd; Address2: Frenchs Forest; Address3: NSW; Address4: Australia 2086; DocumentNumber: 4; SheetNumber: 4; SheetTotal: 11
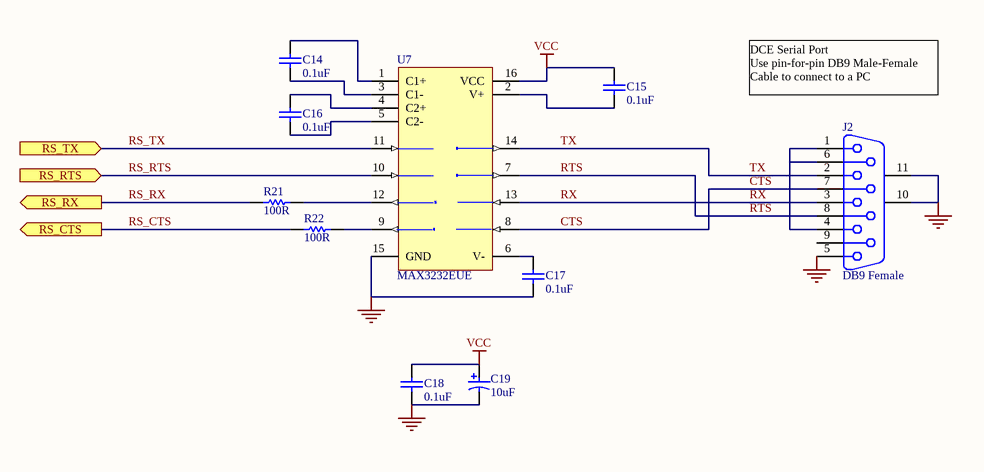
[diagram p6: WC_RS232.SchDoc]

### Parts
C14  0.1uF  [CC2012-0805]
C15  0.1uF  [CC2012-0805]
C16  0.1uF  [CC2012-0805]
C17  0.1uF  [CC2012-0805]
C18  0.1uF  [CC2012-0805]
C19  10uF  [MCCT-B]
J2  DB9 Female  [DSUB1.385-2H9]
R21  100R  [CC2012-0805]
R22  100R  [CC2012-0805]
U7  MAX3232EUE  [SO-G16]

### Ports
RS_CTS (out), RS_RTS (in), RS_RX (out), RS_TX (in)

### Nets
GND: C17.2 C18.2 C19.2 J2.5 J2.10(MH1) J2.11(MH2) U7.15(GND)
VCC: C15.1 C18.1 C19.1 U7.16(VCC)
CTS: J2.7 U7.8(R2IN)
RS_CTS: R22.1 ; port RS_CTS
RS_RTS: U7.10(T2IN) ; port RS_RTS
RS_RX: R21.1 ; port RS_RX
RS_TX: U7.11(T1IN) ; port RS_TX
RTS: J2.8 U7.7(T2OUT)
RX: J2.3 U7.13(R1IN)
TX: J2.2 U7.14(T1OUT)
NetC14_1: C14.1 U7.1(C1+)
NetC14_2: C14.2 U7.3(C1-)
NetC15_2: C15.2 U7.2(V+)
NetC16_1: C16.1 U7.4(C2+)
NetC16_2: C16.2 U7.5(C2-)
NetC17_1: C17.1 U7.6(V-)
NetJ2_1: J2.1 J2.4 J2.6
NetR21_2: R21.2 U7.12(R1OUT)
NetR22_2: R22.2 U7.9(R2OUT)

Not connected (* = marked no-connect by the designer): J2 9

### Notes on the sheet
- DCE Serial Port
  Use pin-for-pin DB9 Male-Female
  Cable to connect to a PC
- Title
- Size:
- Date:
- A
- Number:
- Time:
- Revision:
- Sheet
- of
- File:

### Library data of the parts
C14-C18 = CAP: Capacitor
C19 = CAP_POLAR: Polar Capacitor
J2 = D Connector 9: Receptacle Assembly, 9 Position, Right Angle; Manufacturer: Generic Components; Package Information: Latest Revision: O; Positions: 9; Published: 15-Jun-2001; Revision: July-2002: Re-released for DXP Platform.; Datasheet: (1-Sep-1999); Package Reference: 788750; Publisher: Altium Limited; Class I: Connector; Orientation: Right Angle; Gender: Receptacle
R21 R22 = RES: Resistor
U7 = MAX3232EUE: 3.0V TO 5.5V, Low-Power, up to 1Mbps, True RS-232 Transceiver Using Four 0.1µF External Capacitor; Manufacturer: Maxim,ST; Package Information: Latest Revision: 21-0066 C; Class I: Communication; Published: 16-Jan-2001; Revision: July-2002: Re-released for DXP Platform.; Datasheet: Latest Revision: Mar-1999; Package Reference: TSSOP16; Publisher: Altium Limited; Class II: Transceiver

## Sheet WC_KB.SchDoc
size A; Organization: Altium Limited; Address1: L3, 12a Rodborough Rd; Address2: Frenchs Forest; Address3: NSW; Address4: Australia 2086; DocumentNumber: 7; SheetNumber: 7; SheetTotal: 11
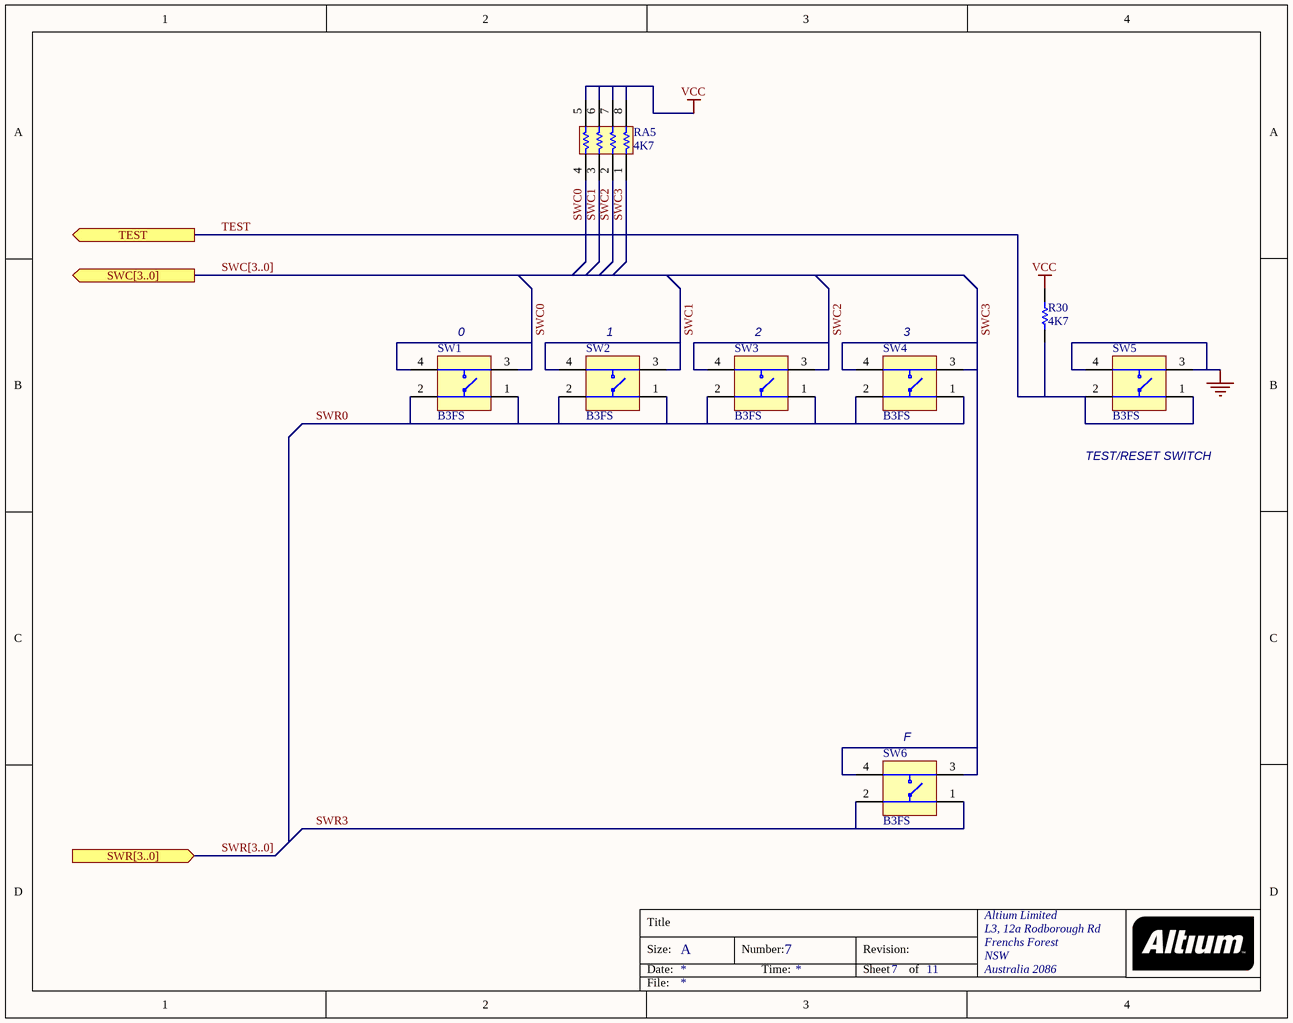
[diagram p7: WC_KB.SchDoc]

### Parts
R30  4K7  [CC2012-0805]
RA5  4K7  [MNR34]
SW1  B3FS  [B3FS_SWITCH]
SW2  B3FS  [B3FS_SWITCH]
SW3  B3FS  [B3FS_SWITCH]
SW4  B3FS  [B3FS_SWITCH]
SW5  B3FS  [B3FS_SWITCH]
SW6  B3FS  [B3FS_SWITCH]

### Ports
SWC[3..0] (out), SWR[3..0] (in), TEST (out)

### Nets
GND: SW5.3 SW5.4
VCC: R30.1 RA5.5 RA5.6 RA5.7 RA5.8
SWC0: RA5.4 SW1.3 SW1.4  [project net KP_COL0]
SWC1: RA5.3 SW2.3 SW2.4  [project net KP_COL1]
SWC2: RA5.2 SW3.3 SW3.4  [project net KP_COL2]
SWC3: RA5.1 SW4.3 SW4.4 SW6.3 SW6.4  [project net KP_COL3]
SWR0: SW1.1 SW1.2 SW2.1 SW2.2 SW3.1 SW3.2 SW4.1 SW4.2  [project net KP_ROW0]
SWR3: SW6.1 SW6.2  [project net KP_ROW3]
TEST: R30.2 SW5.1 SW5.2 ; port TEST

### Buses and harness runs
bus SWC[3..0] = port SWC[3..0]
bus SWR[3..0] = port SWR[3..0]

### Notes on the sheet
- (near SW1) 0
- (near SW2) 1
- (near SW3) 2
- (near SW4) 3
- TEST/RESET SWITCH
- (near SW6) F
- Title
- Size:
- Date:
- A
- Number:
- Time:
- Revision:
- Sheet
- of
- File:

### Library data of the parts
R30 = RES: Resistor
RA5 = MNR34: 3216x4 Resistor Array
SW1-SW6 = B3FS: SPNA SMD Keyboard Switch
  SW1: Comment_1: B3FS

## Sheet WC_PWR.SchDoc
size A; Organization: Altium Limited; Address1: L3, 12a Rodborough Rd; Address2: Frenchs Forest; Address3: NSW; Address4: Australia 2086; DocumentNumber: 3; SheetNumber: 3; SheetTotal: 11
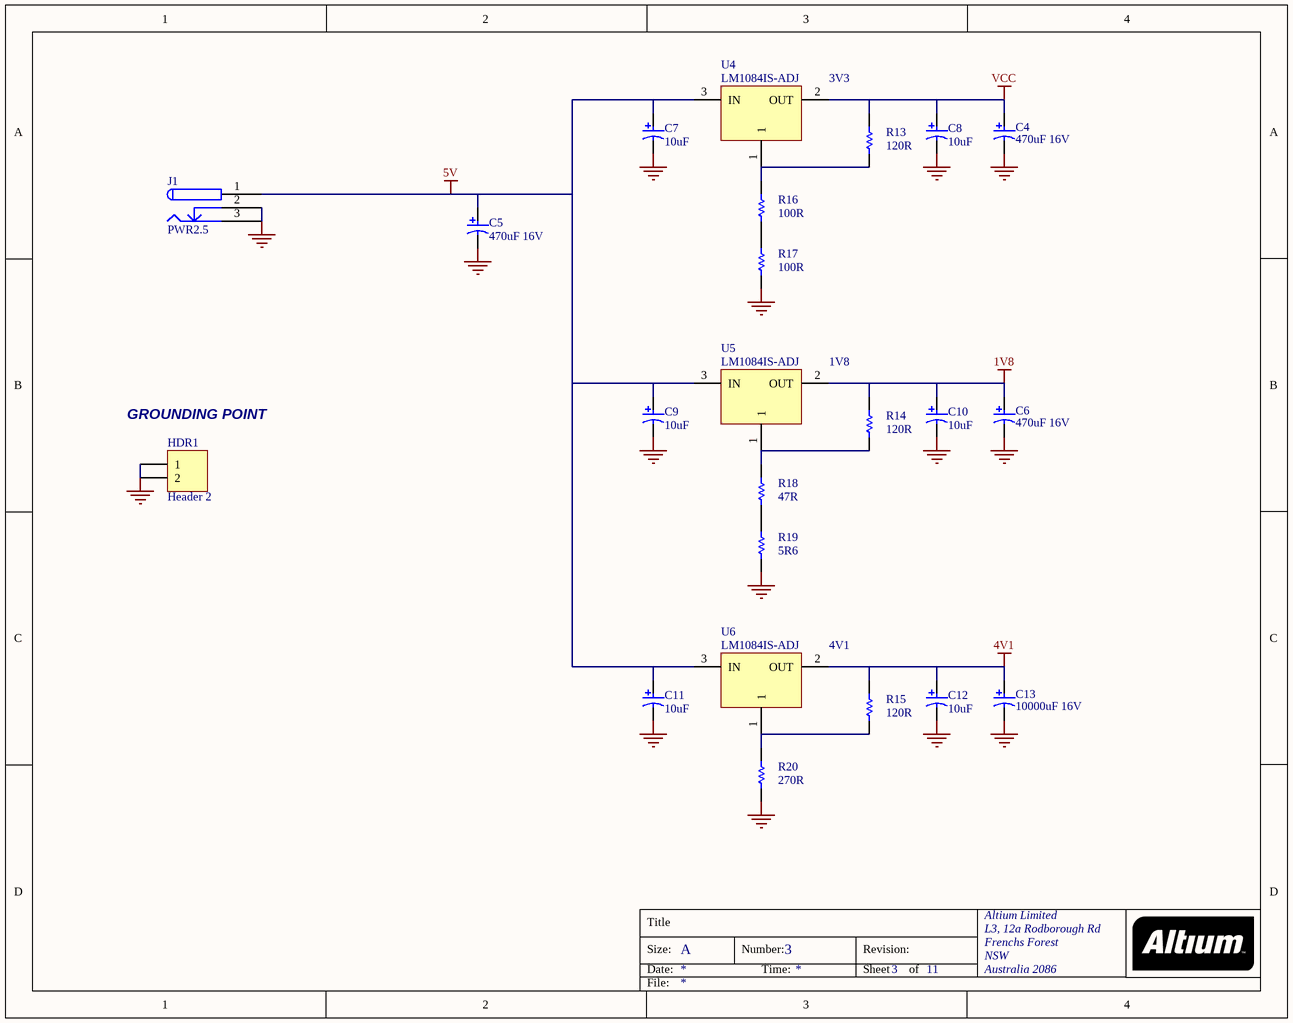
[diagram p8: WC_PWR.SchDoc]

### Parts
C4  470uF 16V  [RB8/3.5]
C5  470uF 16V  [RB8/3.5]
C6  470uF 16V  [RB8/3.5]
C7  10uF  [MCCT-B]
C8  10uF  [MCCT-B]
C9  10uF  [MCCT-B]
C10  10uF  [MCCT-B]
C11  10uF  [MCCT-B]
C12  10uF  [MCCT-B]
C13  10000uF 16V  [RB18/7.5]
HDR1  Header 2  [HDR1X2]
J1  PWR2.5  [PWR2.5]
R13  120R  [CC2012-0805]
R14  120R  [CC2012-0805]
R15  120R  [CC2012-0805]
R16  100R  [CC2012-0805]
R17  100R  [CC2012-0805]
R18  47R  [CC2012-0805]
R19  5R6  [CC2012-0805]
R20  270R  [CC2012-0805]
U4  LM1084IS-ADJ  [TO-263]
U5  LM1084IS-ADJ  [TO-263]
U6  LM1084IS-ADJ  [TO-263]

### Nets
1V8: C6.1 C10.1 R14.1 U5.2(OUT)
4V1: C12.1 C13.1 R15.1 U6.2(OUT)
5V: C5.1 C7.1 C9.1 C11.1 J1.1 U4.3(IN) U5.3(IN) U6.3(IN)
GND: C4.2 C5.2 C6.2 C7.2 C8.2 C9.2 C10.2 C11.2 C12.2 C13.2 HDR1.1 HDR1.2 J1.2 J1.3 R17.2 R19.2 R20.2
VCC: C4.1 C8.1 R13.1 U4.2(OUT)
NetR13_2: R13.2 R16.1 U4.1
NetR14_2: R14.2 R18.1 U5.1
NetR15_2: R15.2 R20.1 U6.1
NetR16_2: R16.2 R17.1
NetR18_2: R18.2 R19.1

### Notes on the sheet
- 3V3
- 1V8
- (near HDR1) GROUNDING POINT
- 4V1
- Title
- Size:
- Date:
- A
- Number:
- Time:
- Revision:
- Sheet
- of
- File:

### Library data of the parts
C4-C13 = CAP_POLAR: Polar Capacitor
HDR1 = Header 2: Header, 2-Pin; Manufacturer: Generic Components; Class I: Connector; Revision: July-2002: Re-released for DXP Platform.; Publisher: Altium Limited
J1 = PWR2.5: Low Voltage Power Supply Sonnector
R13-R20 = RES: Resistor
U4-U6 = LM1084IS-ADJ: 5A Low Dropout Possitive Regulators

## Sheet WC_Boot.SchDoc
size B; Organization: Altium Limited; Address1: L3, 12a Rodborough Rd; Address2: Frenchs Forest; Address3: NSW; Address4: Australia 2086; DocumentNumber: 8; SheetNumber: 8; SheetTotal: 11
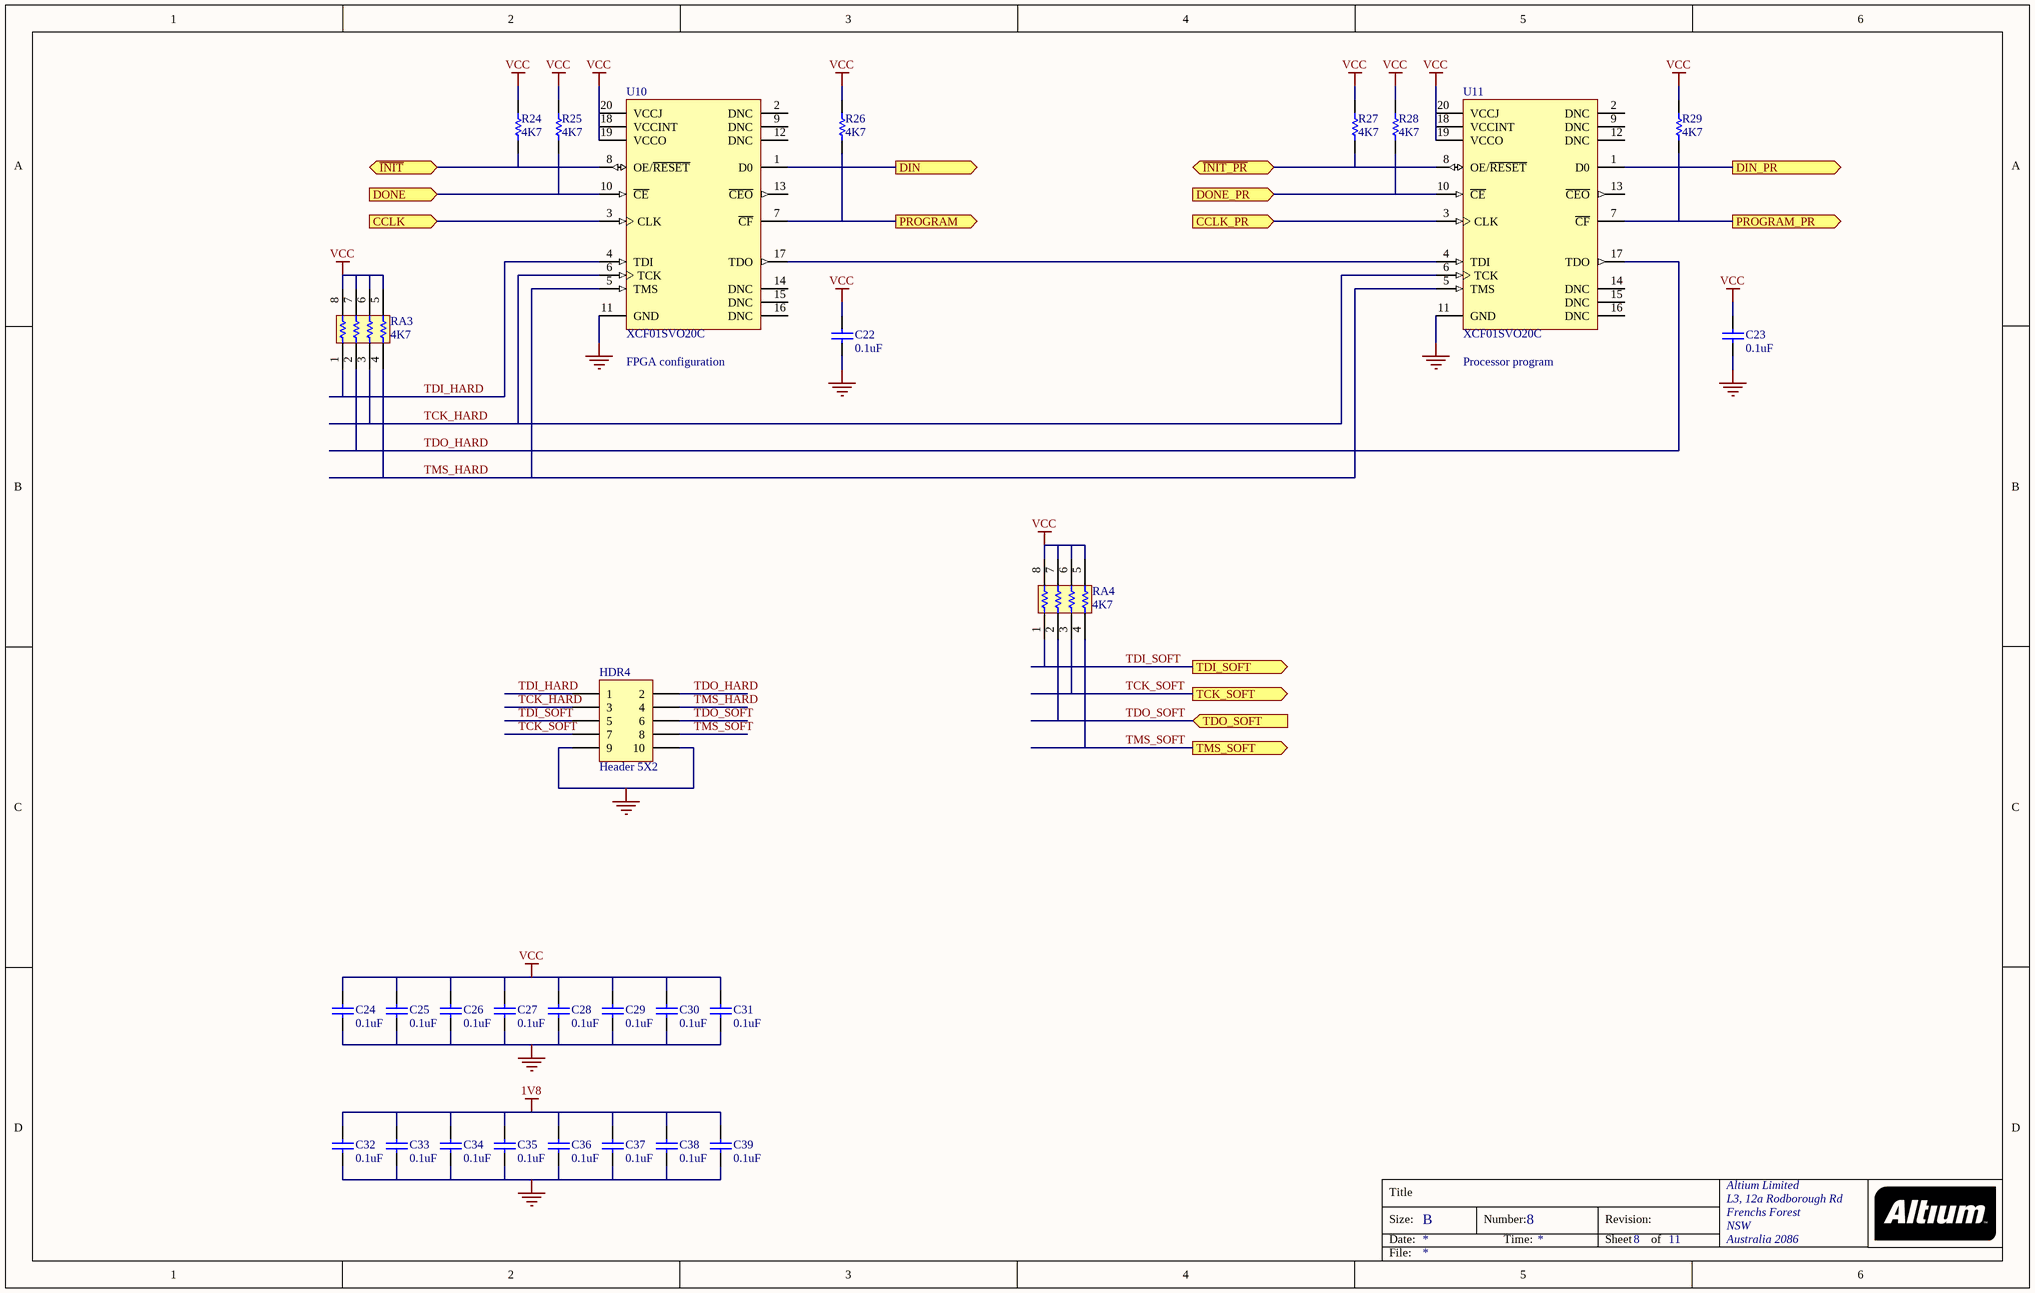
[diagram p9: WC_Boot.SchDoc]

### Parts
C22  0.1uF  [CC2012-0805]
C23  0.1uF  [CC2012-0805]
C24  0.1uF  [CC2012-0805]
C25  0.1uF  [CC2012-0805]
C26  0.1uF  [CC2012-0805]
C27  0.1uF  [CC2012-0805]
C28  0.1uF  [CC2012-0805]
C29  0.1uF  [CC2012-0805]
C30  0.1uF  [CC2012-0805]
C31  0.1uF  [CC2012-0805]
C32  0.1uF  [CC2012-0805]
C33  0.1uF  [CC2012-0805]
C34  0.1uF  [CC2012-0805]
C35  0.1uF  [CC2012-0805]
C36  0.1uF  [CC2012-0805]
C37  0.1uF  [CC2012-0805]
C38  0.1uF  [CC2012-0805]
C39  0.1uF  [CC2012-0805]
HDR4  Header 5X2  [HDR2X5]
R24  4K7  [CC2012-0805]
R25  4K7  [CC2012-0805]
R26  4K7  [CC2012-0805]
R27  4K7  [CC2012-0805]
R28  4K7  [CC2012-0805]
R29  4K7  [CC2012-0805]
RA3  4K7  [MNR34]
RA4  4K7  [MNR34]
U10  XCF01SVO20C  usage: FPGA configuration  [VO20]
U11  XCF01SVO20C  usage: Processor program  [VO20]

### Ports
CCLK (in), CCLK_PR (in), DIN (out), DIN_PR (out), DONE (in), DONE_PR (in), PROGRAM (out), PROGRAM_PR (out), TCK_SOFT (out), TDI_SOFT (out), TDO_SOFT (in), TMS_SOFT (out), ~{INIT_PR} (bidir), ~{INIT} (bidir)

### Nets
1V8: C32.1 C33.1 C34.1 C35.1 C36.1 C37.1 C38.1 C39.1
GND: C22.1 C23.1 C24.2 C25.2 C26.2 C27.2 C28.2 C29.2 C30.2 C31.2 C32.2 C33.2 C34.2 C35.2 C36.2 C37.2 C38.2 C39.2 HDR4.9 HDR4.10 U10.11(GND) U11.11(GND)
VCC: C22.2 C23.2 C24.1 C25.1 C26.1 C27.1 C28.1 C29.1 C30.1 C31.1 R24.1 R25.1 R26.1 R27.1 R28.1 R29.1 RA3.5 RA3.6 RA3.7 RA3.8 RA4.5 RA4.6 RA4.7 RA4.8 U10.18(VCCINT) U10.19(VCCO) U10.20(VCCJ) U11.18(VCCINT) U11.19(VCCO) U11.20(VCCJ)
CCLK: U10.3(CLK) ; port CCLK
CCLK_PR: U11.3(CLK) ; port CCLK_PR
DIN: U10.1(D0) ; port DIN
DIN_PR: U11.1(D0) ; port DIN_PR
DONE: R25.2 U10.10(~{CE}) ; port DONE
DONE_PR: R28.2 U11.10(~{CE}) ; port DONE_PR
~{INIT}: R24.2 U10.8(OE/~{RESET}) ; port ~{INIT}
~{INIT_PR}: R27.2 U11.8(OE/~{RESET}) ; port ~{INIT_PR}
PROGRAM: R26.2 U10.7(~{CF}) ; port PROGRAM
PROGRAM_PR: R29.2 U11.7(~{CF}) ; port PROGRAM_PR
TCK_HARD: HDR4.3 RA3.3 U10.6(TCK) U11.6(TCK)
TCK_SOFT: HDR4.7 RA4.3 ; port TCK_SOFT  [project net JTAG_NEXUS_TCK]
TDI_HARD: HDR4.1 RA3.1 U10.4(TDI)
TDI_SOFT: HDR4.5 RA4.1 ; port TDI_SOFT  [project net JTAG_NEXUS_TDI]
TDO_HARD: HDR4.2 RA3.2 U11.17(TDO)
TDO_SOFT: HDR4.6 RA4.2 ; port TDO_SOFT  [project net JTAG_NEXUS_TDO]
TMS_HARD: HDR4.4 RA3.4 U10.5(TMS) U11.5(TMS)
TMS_SOFT: HDR4.8 RA4.4 ; port TMS_SOFT  [project net JTAG_NEXUS_TMS]
NetU10_17: U10.17(TDO) U11.4(TDI)

Not connected (* = marked no-connect by the designer): U10 2(DNC) 9(DNC) 12(DNC) 13(~{CEO}) 14(DNC) 15(DNC) 16(DNC); U11 2(DNC) 9(DNC) 12(DNC) 13(~{CEO}) 14(DNC) 15(DNC) 16(DNC)

### Notes on the sheet
- Title
- Size:
- Date:
- B
- Number:
- Time:
- Revision:
- Sheet
- of
- File:

### Library data of the parts
C22-C39 = CAP: Capacitor
HDR4 = Header 5X2: Header, 5-Pin, Dual row; Manufacturer: Generic Components; Class I: Connector; Revision: July-2002: Re-released for DXP Platform.; Publisher: Altium Limited
R24-R29 = RES: Resistor
RA3 RA4 = MNR34: 3216x4 Resistor Array
U10 U11 = XCF01SVO20C: XCF00S Series, Platform Flash In-System Programmable Configuration 3.3V PROM, 1-Megabit, Commercial Grade; Manufacturer: Xilinx; Package Information: Latest Revision: ver1.0, May-2003; Class I: Memory; Code - JEDEC: MO-153-AC; Published: 20-Aug-2003; Datasheet: Latest Revision: ver1.1, June-2003; Package Reference: VO20; Publisher: Altium Limited; Class II: PROM

## Sheet WC_MODEM.SchDoc
size A; Organization: Altium Limited; Address1: L3, 12a Rodborough Rd; Address2: Frenchs Forest; Address3: NSW; Address4: Australia 2086; DocumentNumber: 9; SheetNumber: 9; SheetTotal: 11
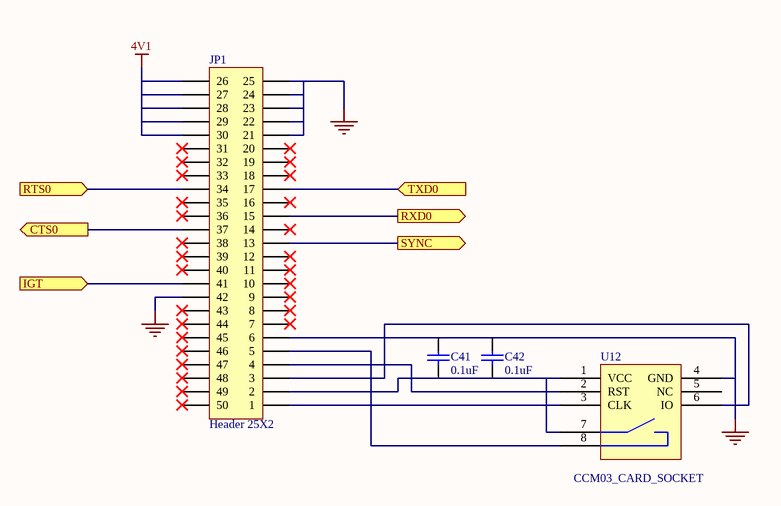
[diagram p10: WC_MODEM.SchDoc]

### Parts
C41  0.1uF  [CC2012-0805]
C42  0.1uF  [CC2012-0805]
JP1  Header 25X2  [MC45]
U12  CCM03_CARD_SOCKET  [CCM03_MKIII]

### Ports
CTS0 (out), IGT (in), RTS0 (in), RXD0 (out), SYNC (out), TXD0 (in)

### Nets
4V1: JP1.26 JP1.27 JP1.28 JP1.29 JP1.30
GND: C41.2 C42.2 JP1.6 JP1.21 JP1.22 JP1.23 JP1.24 JP1.25 JP1.42 U12.4(GND)
GSM_CTS: JP1.37 ; port CTS0
GSM_IGT: JP1.41 ; port IGT
GSM_RTS: JP1.34 ; port RTS0
GSM_RXD: JP1.15 ; port RXD0
GSM_SYNC: JP1.13 ; port SYNC
GSM_TXD: JP1.17 ; port TXD0
NetC41_1: C41.1 C42.1 JP1.2 U12.1(VCC) U12.7
NetJP1_1: JP1.1 U12.3(CLK)
NetJP1_3: JP1.3 U12.6(IO)
NetJP1_4: JP1.4 U12.2(RST)
NetJP1_5: JP1.5 U12.8

Not connected (* = marked no-connect by the designer): JP1 7* 8* 9* 10* 11* 12* 14* 16* 18* 19* 20* 31* 32* 33* 35* 36* 38* 39* 40* 43* 44* 45* 46* 47* 48* 49* 50*; U12 5(NC)

### Notes on the sheet
- Title
- Size:
- Date:
- A
- Number:
- Time:
- Revision:
- Sheet
- of
- File:

### Library data of the parts
C41 C42 = CAP: Capacitor
JP1 = Header 25X2: Header, 25-Pin, Dual row; Manufacturer: Generic Components; Class I: Connector; Revision: July-2002: Re-released for DXP Platform.; Publisher: Altium Limited
U12 = CCM03_CARD_SOCKET: SIM/SAM card connector with card detection switch

## Nets that join several sheets
1V8: FPGA_U1_Auto (12 pins), WC_PWR (C6.1 C10.1 R14.1 U5.2), WC_Boot (8 pins)
4V1: WC_PWR (C12.1 C13.1 R15.1 U6.2), WC_MODEM (5 pins)
5V: WC_LCD (LCD1.15 R11.1), WC_PWR (8 pins)
GND: FPGA_U1_Manual (C1.2 U2.2), FPGA_U1_Auto (26 pins), WC_SENS (R39.1), WC_LCD (8 pins), WC_SRAM (6 pins), WC_VGA (13 pins), WC_RS232 (7 pins), WC_KB (SW5.3 SW5.4), WC_PWR (17 pins), WC_Boot (22 pins), WC_MODEM (10 pins)
VCC: FPGA_U1_Manual (7 pins), FPGA_U1_Auto (17 pins), WC_SENS (R37.1 R38.1 R42.1), WC_LCD (C3.1 R6.2 R12.1 U3.20), WC_SRAM (7 pins), WC_VGA (6 pins), WC_RS232 (C15.1 C18.1 C19.1 U7.16), WC_KB (5 pins), WC_PWR (C4.1 C8.1 R13.1 U4.2), WC_Boot (30 pins)
BLUE0: FPGA_U1_Auto (U1.40), WC_VGA (R33.1)
BLUE1: FPGA_U1_Auto (U1.41), WC_VGA (R36.1)
CCLK: FPGA_U1_Auto (U1.155), WC_Boot (U10.3)
CCLK_PR: FPGA_U1_Auto (U1.198), WC_Boot (U11.3)
CLK_BRD: FPGA_U1_Manual (U2.3), FPGA_U1_Auto (U1.182)
DIN: FPGA_U1_Auto (U1.153), WC_Boot (U10.1)
DIN_PR: FPGA_U1_Auto (U1.199), WC_Boot (U11.1)
DONE: FPGA_U1_Auto (U1.104), WC_Boot (R25.2 U10.10)
DONE_PR: FPGA_U1_Auto (U1.202), WC_Boot (R28.2 U11.10)
GREEN0: FPGA_U1_Auto (U1.42), WC_VGA (R32.1)
GREEN1: FPGA_U1_Auto (U1.43), WC_VGA (R35.1)
GSM_CTS: FPGA_U1_Auto (U1.146), WC_MODEM (JP1.37)
GSM_IGT: FPGA_U1_Auto (U1.147), WC_MODEM (JP1.41)
GSM_RTS: FPGA_U1_Auto (U1.145), WC_MODEM (JP1.34)
GSM_RXD: FPGA_U1_Auto (U1.126), WC_MODEM (JP1.15)
GSM_SYNC: FPGA_U1_Auto (U1.125), WC_MODEM (JP1.13)
GSM_TXD: FPGA_U1_Auto (U1.127), WC_MODEM (JP1.17)
~{INIT}: FPGA_U1_Auto (U1.107), WC_Boot (R24.2 U10.8)
~{INIT_PR}: FPGA_U1_Auto (U1.201), WC_Boot (R27.2 U11.8)
JTAG_NEXUS_TCK: FPGA_U1_Auto (U1.164), WC_Boot (HDR4.7 RA4.3)
JTAG_NEXUS_TDI: FPGA_U1_Auto (U1.166), WC_Boot (HDR4.5 RA4.1)
JTAG_NEXUS_TDO: FPGA_U1_Auto (U1.165), WC_Boot (HDR4.6 RA4.2)
JTAG_NEXUS_TMS: FPGA_U1_Auto (U1.163), WC_Boot (HDR4.8 RA4.4)
KP_COL0: FPGA_U1_Auto (U1.111), WC_KB (RA5.4 SW1.3 SW1.4)
KP_COL1: FPGA_U1_Auto (U1.112), WC_KB (RA5.3 SW2.3 SW2.4)
KP_COL2: FPGA_U1_Auto (U1.113), WC_KB (RA5.2 SW3.3 SW3.4)
KP_COL3: FPGA_U1_Auto (U1.114), WC_KB (5 pins)
KP_ROW0: FPGA_U1_Auto (U1.109), WC_KB (8 pins)
KP_ROW3: FPGA_U1_Auto (U1.110), WC_KB (SW6.1 SW6.2)
LCD_BCKL: FPGA_U1_Auto (U1.34), WC_LCD (R9.1)
LCD_E: FPGA_U1_Auto (U1.108), WC_LCD (LCD1.6 R5.1)
LCD_EDATA: FPGA_U1_Auto (U1.55), WC_LCD (R6.1 U3.19)
PROGRAM: FPGA_U1_Auto (U1.106), WC_Boot (R26.2 U10.7)
PROGRAM_PR: FPGA_U1_Auto (U1.200), WC_Boot (R29.2 U11.7)
RAM0_DATA0: FPGA_U1_Auto (U1.99), WC_LCD (U3.11), WC_SRAM (U8.11)
RAM0_DATA1: FPGA_U1_Auto (U1.100), WC_LCD (U3.12), WC_SRAM (U8.10)
RAM0_DATA2: FPGA_U1_Auto (U1.101), WC_LCD (U3.13), WC_SRAM (U8.22)
RAM0_DATA3: FPGA_U1_Auto (U1.102), WC_LCD (U3.14), WC_SRAM (U8.23)
RAM0_DATA4: FPGA_U1_Auto (U1.46), WC_LCD (U3.15), WC_SRAM (U8.7)
RAM0_DATA5: FPGA_U1_Auto (U1.47), WC_LCD (U3.16), WC_SRAM (U8.26)
RAM0_DATA6: FPGA_U1_Auto (U1.48), WC_LCD (U3.17), WC_SRAM (U8.6)
RAM0_DATA7: FPGA_U1_Auto (U1.49), WC_LCD (U3.18), WC_SRAM (U8.27)
RAM0_OE: FPGA_U1_Auto (U1.56), WC_SRAM (U8.28)
RAM0_WE: FPGA_U1_Auto (U1.98), WC_SRAM (U8.12)
RAM1_DATA0: FPGA_U1_Auto (U1.71), WC_SRAM (U9.6)
RAM1_DATA1: FPGA_U1_Auto (U1.74), WC_SRAM (U9.7)
RAM1_DATA2: FPGA_U1_Auto (U1.75), WC_SRAM (U9.10)
RAM1_DATA3: FPGA_U1_Auto (U1.82), WC_SRAM (U9.11)
RAM1_DATA4: FPGA_U1_Auto (U1.83), WC_SRAM (U9.22)
RAM1_DATA5: FPGA_U1_Auto (U1.81), WC_SRAM (U9.23)
RAM1_DATA6: FPGA_U1_Auto (U1.73), WC_SRAM (U9.26)
RAM1_DATA7: FPGA_U1_Auto (U1.70), WC_SRAM (U9.27)
RAM1_OE: FPGA_U1_Auto (U1.68), WC_SRAM (U9.28)
RAM1_WE: FPGA_U1_Auto (U1.84), WC_SRAM (U9.12)
RAM_ADDR0: FPGA_U1_Auto (U1.58), WC_LCD (LCD1.4), WC_SRAM (U8.1 U9.1)
RAM_ADDR1: FPGA_U1_Auto (U1.60), WC_LCD (LCD1.5 U3.1), WC_SRAM (U8.2 U9.2)
RAM_ADDR2: FPGA_U1_Auto (U1.62), WC_SRAM (U8.3 U9.3)
RAM_ADDR3: FPGA_U1_Auto (U1.64), WC_SRAM (U8.4 U9.4)
RAM_ADDR4: FPGA_U1_Auto (U1.87), WC_SRAM (U8.13 U9.13)
RAM_ADDR5: FPGA_U1_Auto (U1.89), WC_SRAM (U8.14 U9.14)
RAM_ADDR6: FPGA_U1_Auto (U1.94), WC_SRAM (U8.15 U9.15)
RAM_ADDR7: FPGA_U1_Auto (U1.96), WC_SRAM (U8.16 U9.16)
RAM_ADDR8: FPGA_U1_Auto (U1.97), WC_SRAM (U8.17 U9.17)
RAM_ADDR9: FPGA_U1_Auto (U1.95), WC_SRAM (U8.18 U9.18)
RAM_ADDR10: FPGA_U1_Auto (U1.93), WC_SRAM (U8.19 U9.19)
RAM_ADDR11: FPGA_U1_Auto (U1.88), WC_SRAM (U8.20 U9.20)
RAM_ADDR12: FPGA_U1_Auto (U1.86), WC_SRAM (U8.21 U9.21)
RAM_ADDR13: FPGA_U1_Auto (U1.63), WC_SRAM (U8.29 U9.29)
RAM_ADDR14: FPGA_U1_Auto (U1.61), WC_SRAM (U8.30 U9.30)
RAM_ADDR15: FPGA_U1_Auto (U1.59), WC_SRAM (U8.31 U9.31)
RAM_ADDR16: FPGA_U1_Auto (U1.57), WC_SRAM (U8.32 U9.32)
RAM_CS: FPGA_U1_Auto (U1.69), WC_SRAM (R23.2 U8.5 U9.5)
RED0: FPGA_U1_Auto (U1.44), WC_VGA (R31.1)
RED1: FPGA_U1_Auto (U1.45), WC_VGA (R34.1)
RS_CTS: FPGA_U1_Auto (U1.121), WC_RS232 (R22.1)
RS_RTS: FPGA_U1_Auto (U1.120), WC_RS232 (U7.10)
RS_RX: FPGA_U1_Auto (U1.115), WC_RS232 (R21.1)
RS_TX: FPGA_U1_Auto (U1.116), WC_RS232 (U7.11)
SCL: FPGA_U1_Auto (U1.149), WC_SENS (R37.2 U13.5)
SDA: FPGA_U1_Auto (U1.148), WC_SENS (R38.2 U13.6)
SPEED: FPGA_U1_Auto (U1.150), WC_SENS (J4.4 R40.2)
TCK: FPGA_U1_Manual (R3.2), FPGA_U1_Auto (U1.207)
TDI: FPGA_U1_Manual (R2.2), FPGA_U1_Auto (U1.159)
TDO: FPGA_U1_Manual (R1.2), FPGA_U1_Auto (U1.157)
TEST: FPGA_U1_Auto (U1.203), WC_KB (R30.2 SW5.1 SW5.2)
TMS: FPGA_U1_Manual (R4.2), FPGA_U1_Auto (U1.2)
VGA_HSYN: FPGA_U1_Auto (U1.36), WC_VGA (D4.3 J3.13)
VGA_VSYN: FPGA_U1_Auto (U1.35), WC_VGA (D5.3 J3.14)